# Altium project PX4FMUv2.4.6.PrjPcb (part 1 of 2)
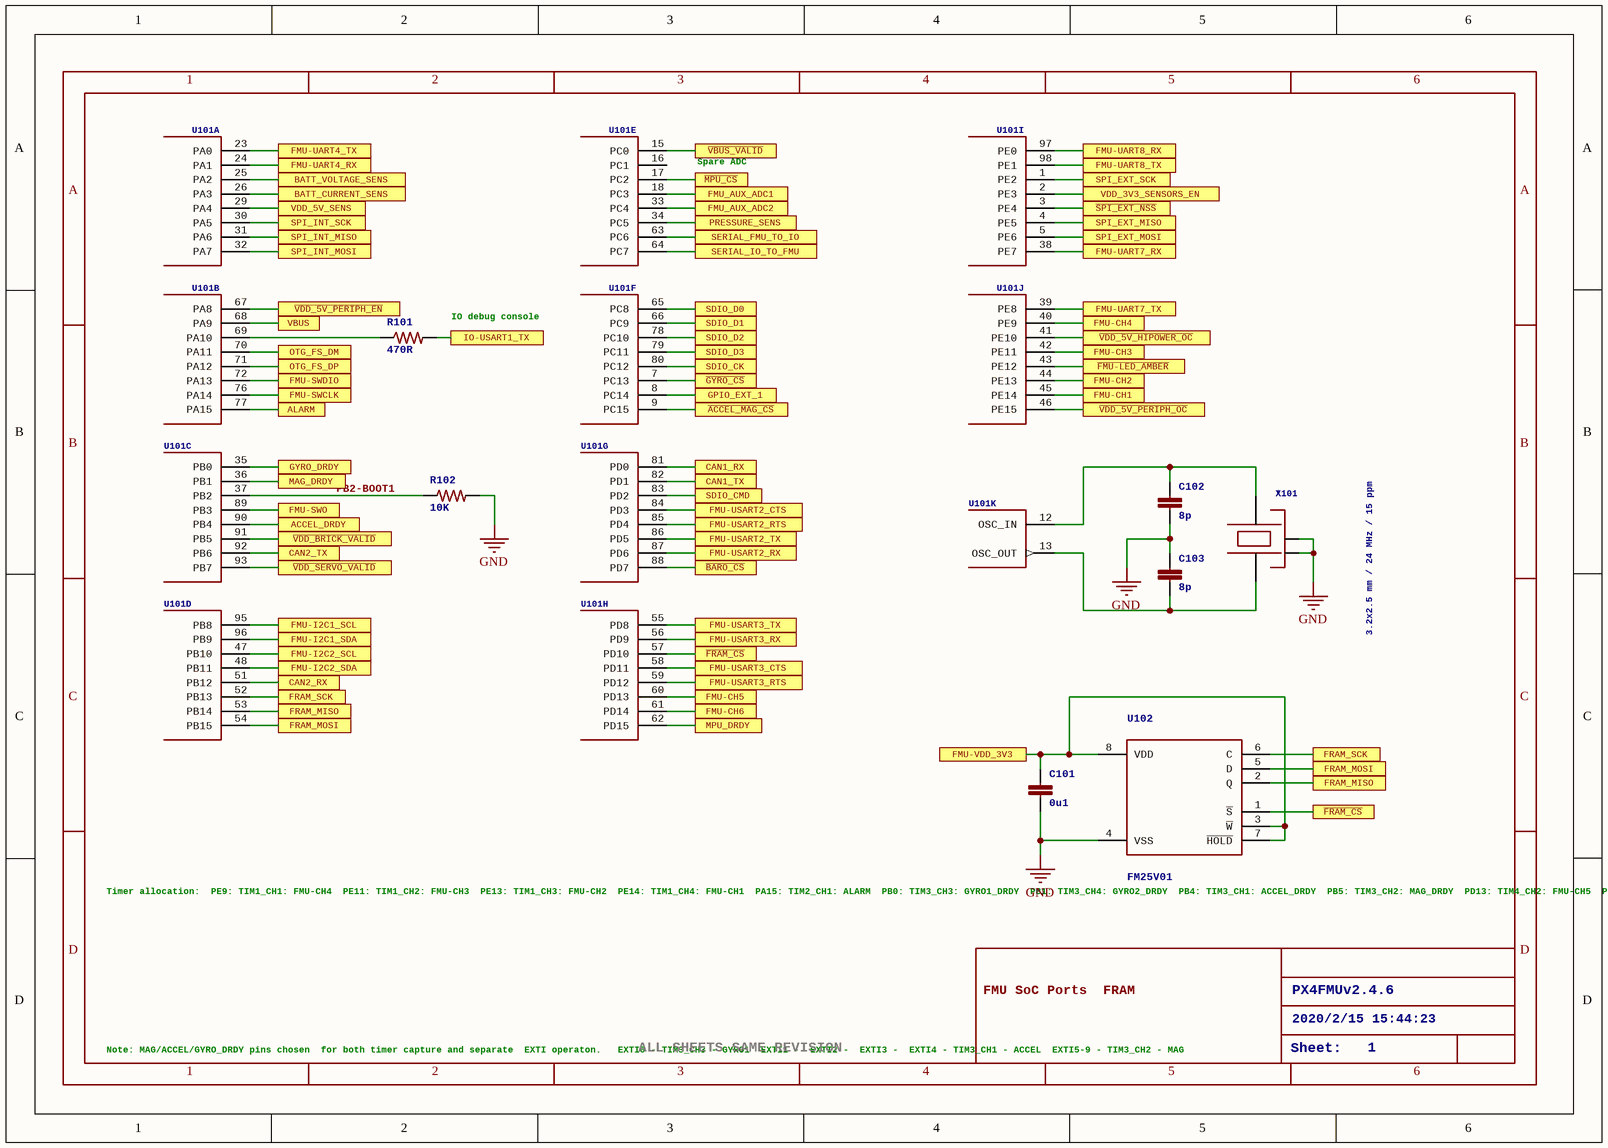
[diagram p0: PX4FMUv2.4.6_0.SchDoc]
12 sheets, 288 parts. Net scope: flat (ports and power ports of the same name join across sheets).
Board file: PX4FMUv2.4.6.PcbDoc
Sheets:
  PX4FMUv2.4.6_0.SchDoc
  PX4FMUv2.4.6_1.SchDoc
  PX4FMUv2.4.6_2.SchDoc
  PX4FMUv2.4.6_3.SchDoc
  PX4FMUv2.4.6_4.SchDoc
  PX4FMUv2.4.6_5.SchDoc
  PX4FMUv2.4.6_6.SchDoc
  PX4FMUv2.4.6_7.SchDoc
  PX4FMUv2.4.6_8.SchDoc
  PX4FMUv2.4.6_9.SchDoc
  PX4FMUv2.4.6_10.SchDoc
  PX4FMUv2.4.6_11.SchDoc

## Sheet PX4FMUv2.4.6_0.SchDoc: PX4FMUv2.4.6
size 282 x 200 mm; Date: 2020/2/15 15:44:23; SheetNumber: 1; GateName_1: G$1; SymbolName_1: A4L-LOC; LibraryName: pixhawk2; DeviceSetName: A4L-LOC

### Parts
C101  0u1  [0402-CAP]
C102  8p  [0402-CAP]
C103  8p  [0402-CAP]
R101  470R  [0402-RES]
R102  10K  [0402-RES]
U101  STM32F4X7VX  [TQFP100]  (value not drawn)  (parts A,B,C,D,E,F,G,H,I,J,K of 14)
U102  FM25V01  [SO08]
X101  3.2x2.5 mm / 24 MHz / 15 ppm  [OSCILLATOR-3.2X2.5]

### Ports
ACCEL_DRDY, ALARM, BATT_CURRENT_SENS, BATT_VOLTAGE_SENS, CAN1_RX, CAN1_TX, CAN2_RX, CAN2_TX, FMU-CH1, FMU-CH2, FMU-CH3, FMU-CH4, FMU-CH5, FMU-CH6, FMU-I2C1_SCL, FMU-I2C1_SDA, FMU-I2C2_SCL, FMU-I2C2_SDA, FMU-SWCLK, FMU-SWDIO, FMU-SWO, FMU-UART4_RX, FMU-UART4_TX, FMU-UART7_RX, FMU-UART7_TX, FMU-UART8_RX, FMU-UART8_TX, FMU-USART2_CTS, FMU-USART2_RTS, FMU-USART2_RX, FMU-USART2_TX, FMU-USART3_CTS, FMU-USART3_RTS, FMU-USART3_RX, FMU-USART3_TX, FMU-VDD_3V3, FMU_AUX_ADC1, FMU_AUX_ADC2, FRAM_MISO, FRAM_MOSI, FRAM_SCK, GPIO_EXT_1, GYRO_DRDY, IO-USART1_TX, MAG_DRDY, MPU_DRDY, OTG_FS_DM, OTG_FS_DP, PRESSURE_SENS, SDIO_CK, SDIO_CMD, SDIO_D0, SDIO_D1, SDIO_D2, SDIO_D3, SERIAL_FMU_TO_IO, SERIAL_IO_TO_FMU, SPI_EXT_MISO, SPI_EXT_MOSI, SPI_EXT_SCK, SPI_INT_MISO, SPI_INT_MOSI, SPI_INT_SCK, VBUS, VDD_3V3_SENSORS_EN, VDD_5V_SENS, ~{ACCEL_MAG_CS}, ~{BARO_CS}, ~{FMU-LED_AMBER}, ~{FRAM_CS}, ~{GYRO_CS}, ~{MPU_CS}, ~{SPI_EXT_NSS}, ~{VBUS_VALID}, ~{VDD_5V_HIPOWER_OC}, ~{VDD_5V_PERIPH_EN}, ~{VDD_5V_PERIPH_OC}, ~{VDD_BRICK_VALID}, ~{VDD_SERVO_VALID}

### Nets
GND: C101.P$2 C102.P$2 C103.P$1 R102.P$2 U102.4(VSS) X101.2(NC_2) X101.4(NC_4)
PB2-BOOT1: R102.P$1 U101.37(PB2)
Net!VBUS_VALID_P$1: U101.15(PC0) ; port ~{VBUS_VALID}
Net!VDD_BRICK_VALID_P$1: U101.91(PB5) ; port ~{VDD_BRICK_VALID}
Net!VDD_SERVO_VALID_P$1: U101.93(PB7) ; port ~{VDD_SERVO_VALID}
NetC101_P$1: C101.P$1 U102.3(~{W}) U102.7(~{HOLD}) U102.8(VDD) ; port FMU-VDD_3V3
NetC102_P$1: C102.P$1 U101.12(OSC_IN) X101.3
NetC103_P$2: C103.P$2 U101.13(OSC_OUT) X101.1
NetC401_P$1: U101.34(PC5) ; port PRESSURE_SENS
NetC1103_P$1: U101.68(PA9) ; port VBUS
NetJ403_2: U101.1(PE2) ; port SPI_EXT_SCK
NetJ403_3: U101.4(PE5) ; port SPI_EXT_MISO
NetJ403_4: U101.5(PE6) ; port SPI_EXT_MOSI
NetJ403_5: U101.3(PE4) ; port ~{SPI_EXT_NSS}
NetJ403_6: U101.8(PC14) ; port GPIO_EXT_1
NetJX301_2: U101.72(PA13) ; port FMU-SWDIO
NetJX301_4: U101.76(PA14) ; port FMU-SWCLK
NetJX301_6: U101.89(PB3) ; port FMU-SWO
NetJX801_1: R101.P$2 ; port IO-USART1_TX
NetR101_P$1: R101.P$1 U101.69(PA10)
NetR215_P$1: U101.92(PB6) ; port CAN2_TX
NetR216_P$1: U101.51(PB12) ; port CAN2_RX
NetR301_P$1: U101.78(PC10) ; port SDIO_D2
NetR302_P$1: U101.79(PC11) ; port SDIO_D3
NetR303_P$1: U101.83(PD2) ; port SDIO_CMD
NetR304_P$1: U101.65(PC8) ; port SDIO_D0
NetR305_P$1: U101.66(PC9) ; port SDIO_D1
NetR306_P$1: U101.47(PB10) ; port FMU-I2C2_SCL
NetR307_P$1: U101.48(PB11) ; port FMU-I2C2_SDA
NetR401_P$1: U101.95(PB8) ; port FMU-I2C1_SCL
NetR402_P$1: U101.96(PB9) ; port FMU-I2C1_SDA
NetR407_P$1: U101.33(PC4) ; port FMU_AUX_ADC2
NetR408_P$1: U101.18(PC3) ; port FMU_AUX_ADC1
NetR602_P$1: U101.41(PE10) ; port ~{VDD_5V_HIPOWER_OC}
NetR603_P$2: U101.2(PE3) ; port VDD_3V3_SENSORS_EN
NetR604_P$1: U101.46(PE15) ; port ~{VDD_5V_PERIPH_OC}
NetR609_P$1: U101.29(PA4) ; port VDD_5V_SENS
NetR615_P$1: U101.67(PA8) ; port ~{VDD_5V_PERIPH_EN}
NetR701_P$2: U101.77(PA15) ; port ALARM
NetR707_P$1: U101.43(PE12) ; port ~{FMU-LED_AMBER}
NetR803_P$2: U101.64(PC7) ; port SERIAL_IO_TO_FMU
NetR804_P$2: U101.63(PC6) ; port SERIAL_FMU_TO_IO
NetR1101_P$1: U101.26(PA3) ; port BATT_CURRENT_SENS
NetR1102_P$1: U101.25(PA2) ; port BATT_VOLTAGE_SENS
NetU101_7: U101.7(PC13) ; port ~{GYRO_CS}
NetU101_9: U101.9(PC15) ; port ~{ACCEL_MAG_CS}
NetU101_17: U101.17(PC2) ; port ~{MPU_CS}
NetU101_23: U101.23(PA0) ; port FMU-UART4_TX
NetU101_24: U101.24(PA1) ; port FMU-UART4_RX
NetU101_30: U101.30(PA5) ; port SPI_INT_SCK
NetU101_31: U101.31(PA6) ; port SPI_INT_MISO
NetU101_32: U101.32(PA7) ; port SPI_INT_MOSI
NetU101_35: U101.35(PB0) ; port GYRO_DRDY
NetU101_36: U101.36(PB1) ; port MAG_DRDY
NetU101_38: U101.38(PE7) ; port FMU-UART7_RX
NetU101_39: U101.39(PE8) ; port FMU-UART7_TX
NetU101_40: U101.40(PE9) ; port FMU-CH4
NetU101_42: U101.42(PE11) ; port FMU-CH3
NetU101_44: U101.44(PE13) ; port FMU-CH2
NetU101_45: U101.45(PE14) ; port FMU-CH1
NetU101_52: U101.52(PB13) U102.6(C) ; port FRAM_SCK
NetU101_53: U101.53(PB14) U102.2(Q) ; port FRAM_MISO
NetU101_54: U101.54(PB15) U102.5(D) ; port FRAM_MOSI
NetU101_55: U101.55(PD8) ; port FMU-USART3_TX
NetU101_56: U101.56(PD9) ; port FMU-USART3_RX
NetU101_57: U101.57(PD10) U102.1(~{S}) ; port ~{FRAM_CS}
NetU101_58: U101.58(PD11) ; port FMU-USART3_CTS
NetU101_59: U101.59(PD12) ; port FMU-USART3_RTS
NetU101_60: U101.60(PD13) ; port FMU-CH5
NetU101_61: U101.61(PD14) ; port FMU-CH6
NetU101_62: U101.62(PD15) ; port MPU_DRDY
NetU101_70: U101.70(PA11) ; port OTG_FS_DM
NetU101_71: U101.71(PA12) ; port OTG_FS_DP
NetU101_80: U101.80(PC12) ; port SDIO_CK
NetU101_81: U101.81(PD0) ; port CAN1_RX
NetU101_82: U101.82(PD1) ; port CAN1_TX
NetU101_84: U101.84(PD3) ; port FMU-USART2_CTS
NetU101_85: U101.85(PD4) ; port FMU-USART2_RTS
NetU101_86: U101.86(PD5) ; port FMU-USART2_TX
NetU101_87: U101.87(PD6) ; port FMU-USART2_RX
NetU101_88: U101.88(PD7) ; port ~{BARO_CS}
NetU101_90: U101.90(PB4) ; port ACCEL_DRDY
NetU101_97: U101.97(PE0) ; port FMU-UART8_RX
NetU101_98: U101.98(PE1) ; port FMU-UART8_TX

Not connected (* = marked no-connect by the designer): U101 16(PC1)

### Notes on the sheet
- Spare ADC
- (near R101) IO debug console
- (near U102) Timer allocation:
  PE9: TIM1_CH1: FMU-CH4
  PE11: TIM1_CH2: FMU-CH3
  PE13: TIM1_CH3: FMU-CH2
  PE14: TIM1_CH4: FMU-CH1
  PA15: TIM2_CH1: ALARM
  PB0: TIM3_CH3: GYRO1_DRDY
  PB1: TIM3_CH4: GYRO2_DRDY
  PB4: TIM3_CH1: ACCEL_DRDY
  PB5: TIM3_CH2: MAG_DRDY
  PD13: TIM4_CH2: FMU-CH5
  PD14: TIM4_CH3: FMU-CH6
  PD15: TIM4_CH4: spare
- FMU SoC Ports
  FRAM
- PX4FMUv2.4.6
- 2020/2/15 15:44:23
- Note: MAG/ACCEL/GYRO_DRDY pins chosen
  for both timer capture and separate
  EXTI operaton.
  EXTI0 - TIM3_CH3 - GYRO1
  EXTI1 -
  EXTI2 -
  EXTI3 -
  EXTI4 - TIM3_CH1 - ACCEL
  EXTI5-9 - TIM3_CH2 - MAG
- ALL SHEETS SAME REVISION
- Sheet:
- 1
- 2
- 3
- 4
- 5
- 6
- A
- B
- C
- D

### Library data of the parts
C101 = CAP0402: CapacitorStandard 0603 ceramic capacitor, and 0.1" leaded capacitor.; PARTNO: CC0402ZRY5V7BB104; GateName_1: G$1; SymbolName_1: CAP; DeviceName: 0402; LibraryName: pixhawk2; DeviceSetName: CAP
C102 C103 = CAP0402: CapacitorStandard 0603 ceramic capacitor, and 0.1" leaded capacitor.; PARTNO: C1005C0G1H080C; GateName_1: G$1; SymbolName_1: CAP; DeviceName: 0402; LibraryName: pixhawk2; DeviceSetName: CAP
R101 = RESISTOR0402-RES: ResistorBasic schematic elements and footprints for 0603, 1206, and PTH 1/10th watt (small) resistors.; PARTNO: RC0402FR-07470RL; GateName_1: G$1; SymbolName_1: RESISTOR; DeviceName: 0402-RES; LibraryName: pixhawk2; DeviceSetName: RESISTOR
R102 = RESISTOR0402-RES: ResistorBasic schematic elements and footprints for 0603, 1206, and PTH 1/10th watt (small) resistors.; PARTNO: RC0402FR-0710KL; GateName_1: G$1; SymbolName_1: RESISTOR; DeviceName: 0402-RES; LibraryName: pixhawk2; DeviceSetName: RESISTOR
U101 = STM32F4X7VX: STM32F4X7VX 100 pin LQFP STM32F407VE - 512 KB flash, no crypto STM32F407VG - 1 MB flash, no crypto STM32F417VE - 512 KB flash, with crypto STM32F417VG - 1 MB flash, with crypto; PARTNO: STM32F427VI; GateName_1: PORTA_L; SymbolName_1: PORT_A_L-1; GateName_2: PORTA_H; SymbolName_2: PORT_A_H-1; GateName_3: PORTB_L; SymbolName_3: PORT_B_L-1; GateName_4: PORTB_H; SymbolName_4: PORT_B_H-1; GateName_5: PORTC_L; SymbolName_5: PORT_C_L-1; GateName_6: PORTC_H; SymbolName_6: PORT_C_H-1; GateName_7: PORTD_L; SymbolName_7: PORT_D_L; GateName_8: PORTD_H; SymbolName_8: PORT_D_H; GateName_9: PORTE_L; SymbolName_9: PORT_E_L; GateName_10: PORTE_H; SymbolName_10: PORT_E_H; GateName_11: OSC; GateName_12: RESET; SymbolName_12: BOOT_RST-1; GateName_13: BAT; SymbolName_13: STM32F4X_BAT_AN_L; GateName_14: G$2; SymbolName_14: STM32F4X_VCC_VSS_L; SymbolName_11: OSC; LibraryName: pixhawk2; DeviceSetName: STM32F4X7VX
U102 = FM25V01: FM25V01 128Kb Serial 3V F-RAM Memory; PARTNO: FM25V01-G; GateName_1: G$1; SymbolName_1: FM25V01; LibraryName: pixhawk2; DeviceSetName: FM25V01; DATASHEET: http://www.ramtron.com/files/datasheets/FM25V01_ds.pdf; LINK: http://www.digikey.com/product-detail/en/FM25V01-GTR/1140-1026-1-ND/2809832; MFGPN: FM25V01
X101 = OSCILLATOR-3.2X2.5: Crystal Oscillator in 3.2x2.5 SMD; PARTNO: NX3225SA-24.000000MHZ; GateName_1: G$1; SymbolName_1: XTAL; DeviceName: -3.2X2.5; LibraryName: pixhawk2; DeviceSetName: OSCILLATOR; NAME: *

## Sheet PX4FMUv2.4.6_1.SchDoc: PX4FMUv2.4.6
size 282 x 200 mm; Date: 2020/2/15 15:44:24; SheetNumber: 2; GateName_1: G$1; SymbolName_1: A4L-LOC; LibraryName: pixhawk2; DeviceSetName: A4L-LOC
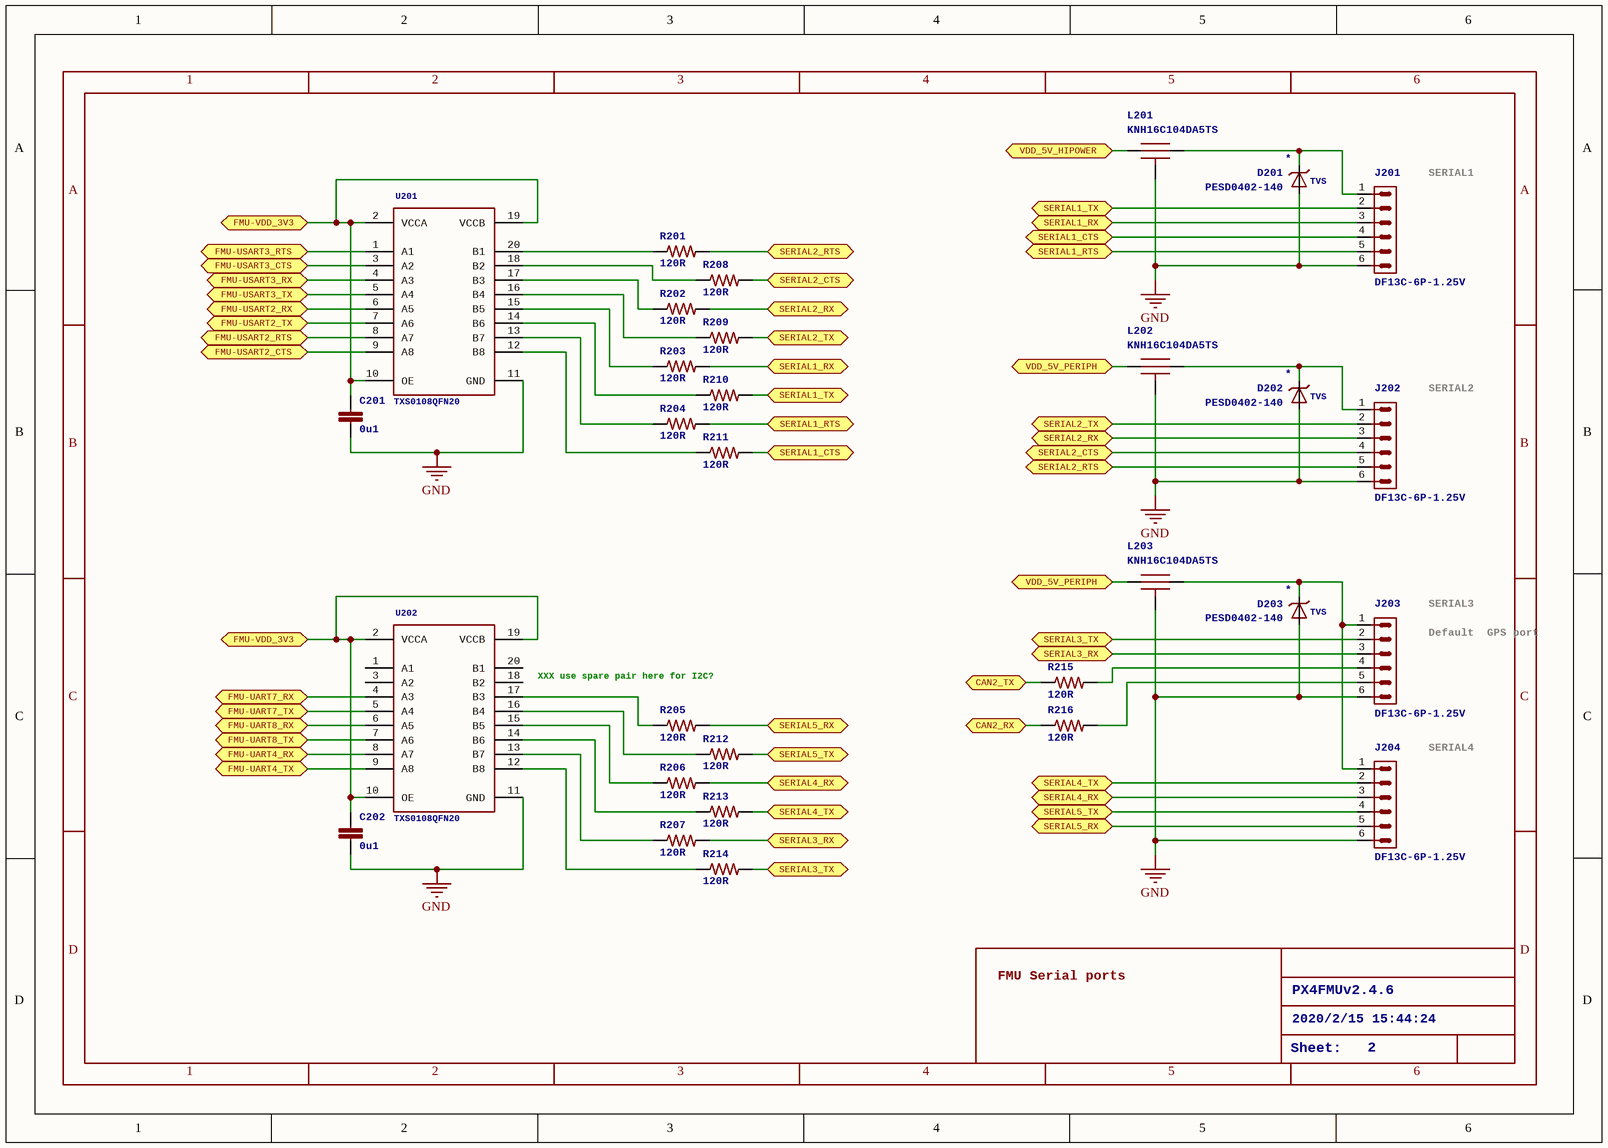
[diagram p1: PX4FMUv2.4.6_1.SchDoc]

### Parts
C201  0u1  [0402-CAP]
C202  0u1  [0402-CAP]
D201  PESD0402-140  [0402-TVS]
D202  PESD0402-140  [0402-TVS]
D203  PESD0402-140  [0402-TVS]
J201  DF13C-6P-1.25V  [DF13C-6P-1.25V]
J202  DF13C-6P-1.25V  [DF13C-6P-1.25V]
J203  DF13C-6P-1.25V  [DF13C-6P-1.25V]
J204  DF13C-6P-1.25V  [DF13C-6P-1.25V]
L201  KNH16C104DA5TS  [KYOCERA-KNH16-DA]
L202  KNH16C104DA5TS  [KYOCERA-KNH16-DA]
L203  KNH16C104DA5TS  [KYOCERA-KNH16-DA]
R201  120R  [0402-RES]
R202  120R  [0402-RES]
R203  120R  [0402-RES]
R204  120R  [0402-RES]
R205  120R  [0402-RES]
R206  120R  [0402-RES]
R207  120R  [0402-RES]
R208  120R  [0402-RES]
R209  120R  [0402-RES]
R210  120R  [0402-RES]
R211  120R  [0402-RES]
R212  120R  [0402-RES]
R213  120R  [0402-RES]
R214  120R  [0402-RES]
R215  120R  [0402-RES]
R216  120R  [0402-RES]
U201  TXS0108QFN20  [QFN20-RGY]
U202  TXS0108QFN20  [QFN20-RGY]

### Ports
CAN2_RX, CAN2_TX, FMU-UART4_RX, FMU-UART4_TX, FMU-UART7_RX, FMU-UART7_TX, FMU-UART8_RX, FMU-UART8_TX, FMU-USART2_CTS, FMU-USART2_RTS, FMU-USART2_RX, FMU-USART2_TX, FMU-USART3_CTS, FMU-USART3_RTS, FMU-USART3_RX, FMU-USART3_TX, FMU-VDD_3V3, SERIAL1_CTS, SERIAL1_RTS, SERIAL1_RX, SERIAL1_TX, SERIAL2_CTS, SERIAL2_RTS, SERIAL2_RX, SERIAL2_TX, SERIAL3_RX, SERIAL3_TX, SERIAL4_RX, SERIAL4_TX, SERIAL5_RX, SERIAL5_TX, VDD_5V_HIPOWER, VDD_5V_PERIPH

### Nets
GND: C201.P$2 C202.P$2 D201.A D202.A D203.A J201.6 J202.6 J203.6 J204.6 L201.P$3_P$4_P$5(P$3) L202.P$3_P$4_P$5(P$3) L203.P$3_P$4_P$5(P$3) U201.11(GND) U202.11(GND)
NetC101_P$1: C201.P$1 C202.P$1 U201.2(VCCA) U201.10(OE) U201.19(VCCB) U202.2(VCCA) U202.10(OE) U202.19(VCCB) ; port FMU-VDD_3V3
NetC614_P$1: L201.P$1 ; port VDD_5V_HIPOWER
NetC618_P$1: L202.P$1 L203.P$1 ; port VDD_5V_PERIPH
NetD201_C: D201.C J201.1 L201.P$2
NetD202_C: D202.C J202.1 L202.P$2
NetD203_C: D203.C J203.1 J204.1 L203.P$2
NetJ201_2: J201.2 R210.P$2 ; port SERIAL1_TX
NetJ201_3: J201.3 R203.P$2 ; port SERIAL1_RX
NetJ201_4: J201.4 R211.P$2 ; port SERIAL1_CTS
NetJ201_5: J201.5 R204.P$2 ; port SERIAL1_RTS
NetJ202_2: J202.2 R209.P$2 ; port SERIAL2_TX
NetJ202_3: J202.3 R202.P$2 ; port SERIAL2_RX
NetJ202_4: J202.4 R208.P$2 ; port SERIAL2_CTS
NetJ202_5: J202.5 R201.P$2 ; port SERIAL2_RTS
NetJ203_2: J203.2 R214.P$2 ; port SERIAL3_TX
NetJ203_3: J203.3 R207.P$2 ; port SERIAL3_RX
NetJ203_4: J203.4 R215.P$2
NetJ203_5: J203.5 R216.P$2
NetJ204_2: J204.2 R213.P$2 ; port SERIAL4_TX
NetJ204_3: J204.3 R206.P$2 ; port SERIAL4_RX
NetJ204_4: J204.4 R212.P$2 ; port SERIAL5_TX
NetJ204_5: J204.5 R205.P$2 ; port SERIAL5_RX
NetR201_P$1: R201.P$1 U201.20(B1)
NetR202_P$1: R202.P$1 U201.17(B3)
NetR203_P$1: R203.P$1 U201.15(B5)
NetR204_P$1: R204.P$1 U201.13(B7)
NetR205_P$1: R205.P$1 U202.17(B3)
NetR206_P$1: R206.P$1 U202.15(B5)
NetR207_P$1: R207.P$1 U202.13(B7)
NetR208_P$1: R208.P$1 U201.18(B2)
NetR209_P$1: R209.P$1 U201.16(B4)
NetR210_P$1: R210.P$1 U201.14(B6)
NetR211_P$1: R211.P$1 U201.12(B8)
NetR212_P$1: R212.P$1 U202.16(B4)
NetR213_P$1: R213.P$1 U202.14(B6)
NetR214_P$1: R214.P$1 U202.12(B8)
NetR215_P$1: R215.P$1 ; port CAN2_TX
NetR216_P$1: R216.P$1 ; port CAN2_RX
NetU101_23: U202.9(A8) ; port FMU-UART4_TX
NetU101_24: U202.8(A7) ; port FMU-UART4_RX
NetU101_38: U202.4(A3) ; port FMU-UART7_RX
NetU101_39: U202.5(A4) ; port FMU-UART7_TX
NetU101_55: U201.5(A4) ; port FMU-USART3_TX
NetU101_56: U201.4(A3) ; port FMU-USART3_RX
NetU101_58: U201.3(A2) ; port FMU-USART3_CTS
NetU101_59: U201.1(A1) ; port FMU-USART3_RTS
NetU101_84: U201.9(A8) ; port FMU-USART2_CTS
NetU101_85: U201.8(A7) ; port FMU-USART2_RTS
NetU101_86: U201.7(A6) ; port FMU-USART2_TX
NetU101_87: U201.6(A5) ; port FMU-USART2_RX
NetU101_97: U202.6(A5) ; port FMU-UART8_RX
NetU101_98: U202.7(A6) ; port FMU-UART8_TX

Not connected (* = marked no-connect by the designer): U202 1(A1) 3(A2) 18(B2) 20(B1)

### Notes on the sheet
- SERIAL1
- SERIAL2
- SERIAL3
- Default
  GPS port
- XXX use spare pair here for I2C?
- SERIAL4
- FMU Serial ports
- PX4FMUv2.4.6
- 2020/2/15 15:44:24
- Sheet:
- 2
- 1
- 3
- 4
- 5
- 6
- A
- B
- C
- D

### Library data of the parts
C201 C202 = CAP0402: as C101 on sheet PX4FMUv2.4.6_0; LibraryName: pixhawk2; DeviceSetName: CAP
D201-D203 = DIODE-TVS: GateName_1: G$1; SymbolName_1: DIODE-TVS; LibraryName: pixhawk2; DeviceSetName: DIODE-TVS; NAME: *; PARTNO: PESD0402-140; TVS: TVS
J201-J204 = DF13-6P-1.25V: DF13-6P 1.25mm Pitch Miniature Crimping Connector.; PARTNO: DF13C-6P-1.25V(20); GateName_1: G$1; SymbolName_1: CON-1X6P; DeviceName: V; LibraryName: con-hirose-df13; DeviceSetName: DF13-6P-1.25
L201-L203 = KNH16C104DA5TS: Kyocera KNH16C104DA5TS EMI filter; GateName_1: G$1; SymbolName_1: CAP-FEEDTHROUGH; LibraryName: pixhawk2; DeviceSetName: KNH16C104DA5TS; PARTNO: KNH16C104DA5TS
R201-R216 = RESISTOR0402-RES: ResistorBasic schematic elements and footprints for 0603, 1206, and PTH 1/10th watt (small) resistors.; PARTNO: RC0402FR-07120RL; GateName_1: G$1; SymbolName_1: RESISTOR; DeviceName: 0402-RES; LibraryName: pixhawk2; DeviceSetName: RESISTOR
U201 U202 = TXS0108QFN20: PARTNO: TXS0108ERGYR; GateName_1: G$1; SymbolName_1: TX?0108; DeviceName: QFN20; LibraryName: pixhawk2; DeviceSetName: TXS0108

## Sheet PX4FMUv2.4.6_2.SchDoc: PX4FMUv2.4.6
size 282 x 200 mm; Date: 2020/2/15 15:44:25; SheetNumber: 3; GateName_1: G$1; SymbolName_1: A4L-LOC; LibraryName: pixhawk2; DeviceSetName: A4L-LOC
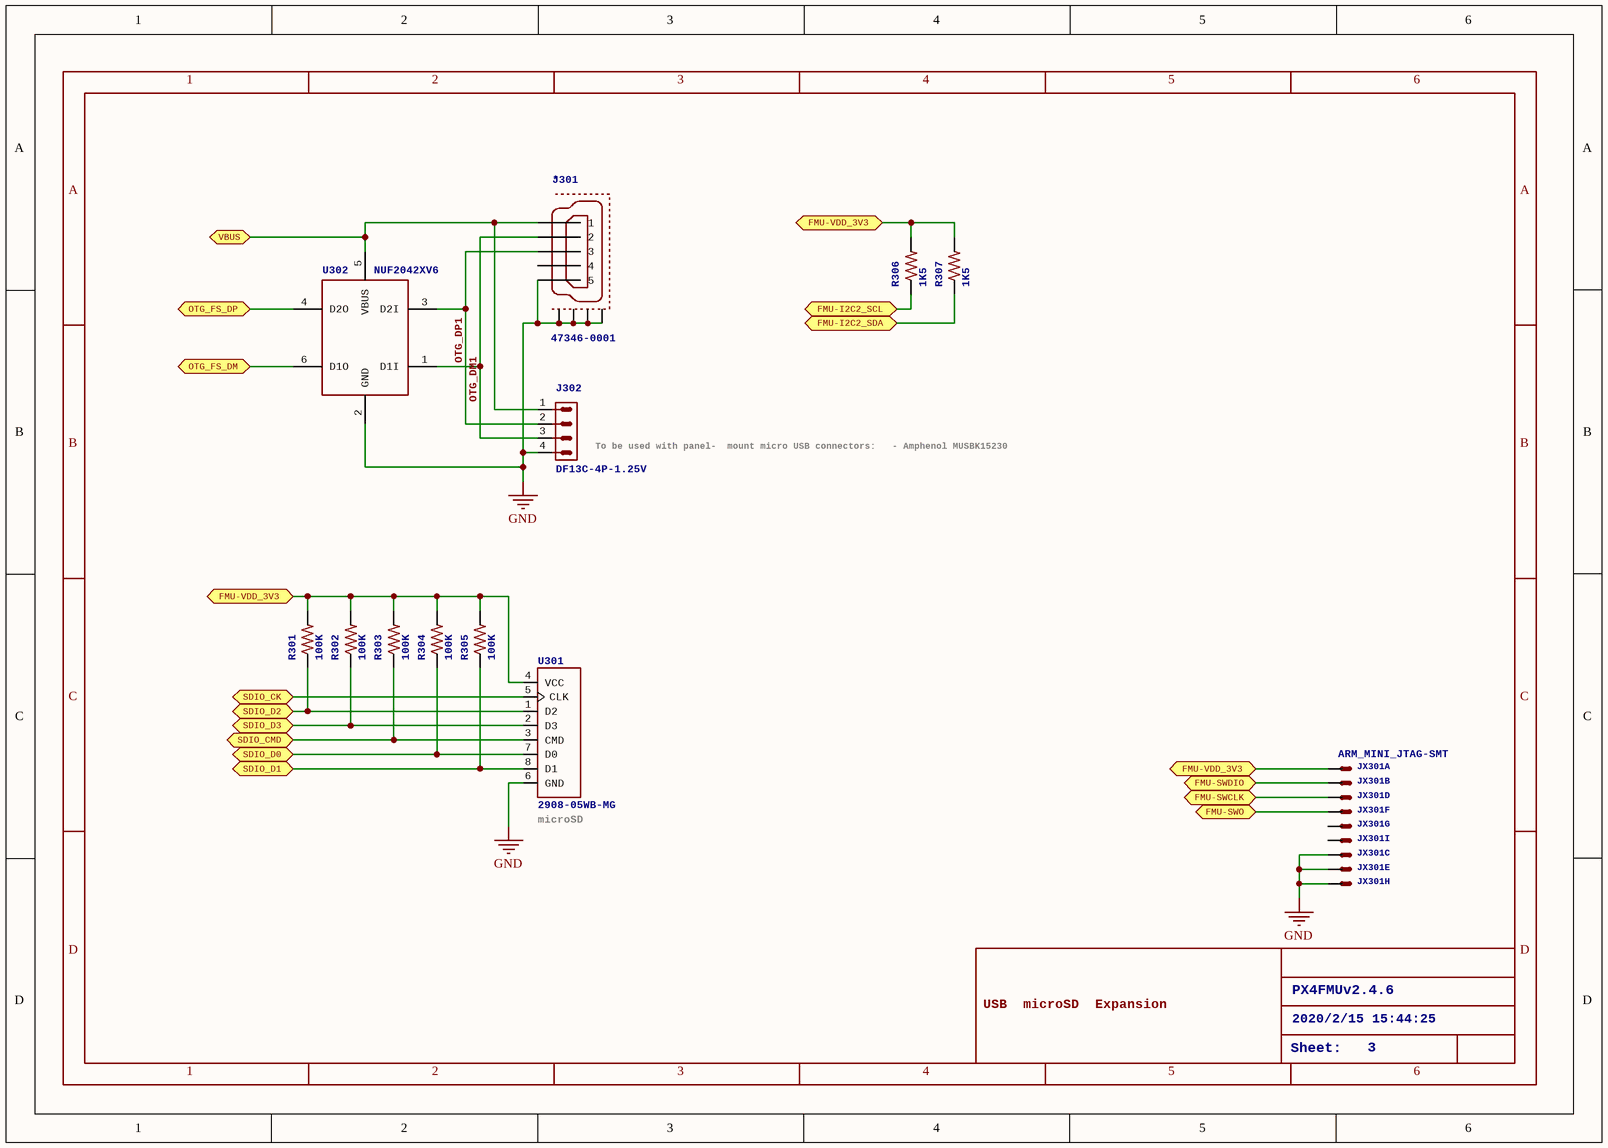
[diagram p2: PX4FMUv2.4.6_2.SchDoc]

### Parts
J301  47346-0001  [MOLEX-47346-0001]
J302  DF13C-4P-1.25V  [DF13C-4P-1.25V]
JX301  ARM_MINI_JTAG-SMT  [FTSH-105-01-XXX-DV-K]  (parts A,B,C,D,E,F,G,H,I of 9)
R301  100K  [0402-RES]
R302  100K  [0402-RES]
R303  100K  [0402-RES]
R304  100K  [0402-RES]
R305  100K  [0402-RES]
R306  1K5  [0402-RES]
R307  1K5  [0402-RES]
U301  2908-05WB-MG  [MICROSD]
U302  NUF2042XV6  [SOT563-6]

### Ports
FMU-I2C2_SCL, FMU-I2C2_SDA, FMU-SWCLK, FMU-SWDIO, FMU-SWO, FMU-VDD_3V3, OTG_FS_DM, OTG_FS_DP, SDIO_CK, SDIO_CMD, SDIO_D0, SDIO_D1, SDIO_D2, SDIO_D3, VBUS

### Nets
GND: J301.GND(5) J301.GND1 J301.GND2 J301.GND3 J301.GND4 J302.4 JX301.3(S) JX301.5(S) JX301.9(S) U301.6(GND) U302.2(GND)
OTG_DM1: J301.D-(2) J302.3 U302.1(D1I)
OTG_DP1: J301.D+(3) J302.2 U302.3(D2I)
NetC101_P$1: JX301.1(S) R301.P$2 R302.P$2 R303.P$2 R304.P$2 R305.P$2 R306.P$2 R307.P$2 U301.4(VCC) ; port FMU-VDD_3V3
NetC1103_P$1: J301.VBUS(1) J302.1 U302.5(VBUS) ; port VBUS
NetJX301_2: JX301.2(S) ; port FMU-SWDIO
NetJX301_4: JX301.4(S) ; port FMU-SWCLK
NetJX301_6: JX301.6(S) ; port FMU-SWO
NetR301_P$1: R301.P$1 U301.1(D2) ; port SDIO_D2
NetR302_P$1: R302.P$1 U301.2(D3) ; port SDIO_D3
NetR303_P$1: R303.P$1 U301.3(CMD) ; port SDIO_CMD
NetR304_P$1: R304.P$1 U301.7(D0) ; port SDIO_D0
NetR305_P$1: R305.P$1 U301.8(D1) ; port SDIO_D1
NetR306_P$1: R306.P$1 ; port FMU-I2C2_SCL
NetR307_P$1: R307.P$1 ; port FMU-I2C2_SDA
NetU101_70: U302.6(D1O) ; port OTG_FS_DM
NetU101_71: U302.4(D2O) ; port OTG_FS_DP
NetU101_80: U301.5(CLK) ; port SDIO_CK

Not connected (* = marked no-connect by the designer): J301 ID(4); JX301 8(S) 10(S)

### Notes on the sheet
- (near J302) To be used with panel-
  mount micro USB connectors:
  - Amphenol MUSBK15230
- (near U301) microSD
- USB
  microSD
  Expansion
- PX4FMUv2.4.6
- 2020/2/15 15:44:25
- Sheet:
- 3
- 1
- 2
- 4
- 5
- 6
- A
- B
- C
- D

### Library data of the parts
J301 = MOLEX-47346-0001: MICRO USB B, BOTTOM MOUNT; GateName_1: G$1; SymbolName_1: MINI-USB; LibraryName: pixhawk2; DeviceSetName: MOLEX-47346-0001; NAME: *; PARTNO: 47346-0001
J302 = DF13-4P-1.25V: DF13-4P 1.25mm Pitch Miniature Crimping Connector.; PARTNO: DF13C-4P-1.25V(20); GateName_1: G$1; SymbolName_1: CON-1X4P; DeviceName: V; LibraryName: con-hirose-df13; DeviceSetName: DF13-4P-1.25
JX301 = ARM_MINI_JTAG-SMT: CONNECTORwire to board 1.25 mm (.049 inch) pitch header; PARTNO: M50-3900542; GateName_1: -VTREF; SymbolName_1: MV; GateName_2: -TMS/SWDIO; SymbolName_2: M; GateName_3: -GND1; GateName_4: -TCK/SWCLK; GateName_5: -GND2; GateName_6: -TDO/SWO; GateName_7: -TDI/EXTB; GateName_8: -GND3; GateName_9: -!RESET; DeviceName: -SMT; BOM: EXCLUDE; SymbolName_3: M; SymbolName_4: M; SymbolName_5: M; SymbolName_6: M; SymbolName_7: M; SymbolName_8: M; SymbolName_9: M; LibraryName: pixhawk2; DeviceSetName: ARM_MINI_JTAG
R301-R305 = RESISTOR0402-RES: ResistorBasic schematic elements and footprints for 0603, 1206, and PTH 1/10th watt (small) resistors.; PARTNO: RC0402FR-07100KL; GateName_1: G$1; SymbolName_1: RESISTOR; DeviceName: 0402-RES; LibraryName: pixhawk2; DeviceSetName: RESISTOR
R306 R307 = RESISTOR0402-RES: ResistorBasic schematic elements and footprints for 0603, 1206, and PTH 1/10th watt (small) resistors.; PARTNO: RC0402FR-071K5L; GateName_1: G$1; SymbolName_1: RESISTOR; DeviceName: 0402-RES; LibraryName: pixhawk2; DeviceSetName: RESISTOR
U301 = MICROSDSDI: GateName_1: G$1; SymbolName_1: MICROSDSDI; LibraryName: baseboard; DeviceSetName: MICROSDSDI; PARTNO: 2908-05WB-MG
U302 = NUF2042XV6: PARTNO: NUF2042XV6T1G; GateName_1: G$1; SymbolName_1: NUF20X0XV6; LibraryName: pixhawk2; DeviceSetName: NUF2042XV6

## Sheet PX4FMUv2.4.6_3.SchDoc: PX4FMUv2.4.6
size 282 x 200 mm; Date: 2020/2/15 15:44:26; SheetNumber: 4; GateName_1: G$1; SymbolName_1: A4L-LOC; LibraryName: pixhawk2; DeviceSetName: A4L-LOC
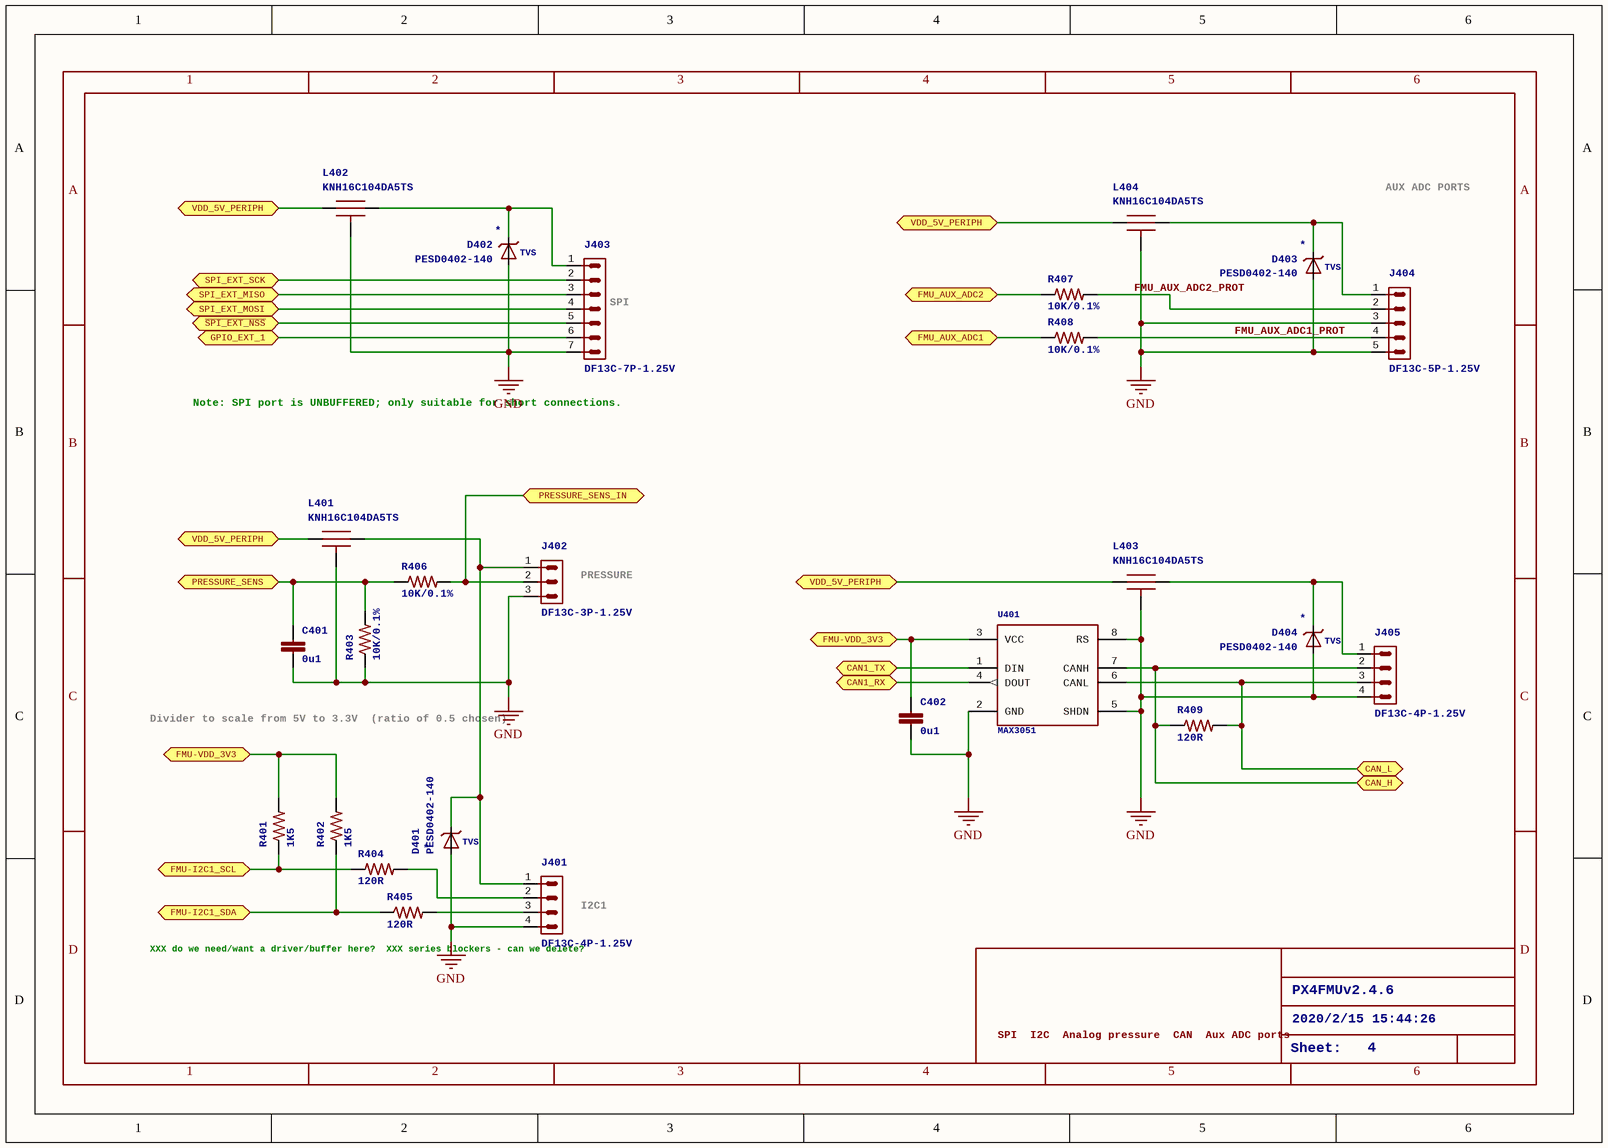
[diagram p3: PX4FMUv2.4.6_3.SchDoc]

### Parts
C401  0u1  [0402-CAP]
C402  0u1  [0402-CAP]
D401  PESD0402-140  [0402-TVS]
D402  PESD0402-140  [0402-TVS]
D403  PESD0402-140  [0402-TVS]
D404  PESD0402-140  [0402-TVS]
J401  DF13C-4P-1.25V  [DF13C-4P-1.25V]
J402  DF13C-3P-1.25V  [DF13C-3P-1.25V]
J403  DF13C-7P-1.25V  [DF13C-7P-1.25V]
J404  DF13C-5P-1.25V  [DF13C-5P-1.25V]
J405  DF13C-4P-1.25V  [DF13C-4P-1.25V]
L401  KNH16C104DA5TS  [KYOCERA-KNH16-DA]
L402  KNH16C104DA5TS  [KYOCERA-KNH16-DA]
L403  KNH16C104DA5TS  [KYOCERA-KNH16-DA]
L404  KNH16C104DA5TS  [KYOCERA-KNH16-DA]
R401  1K5  [0402-RES]
R402  1K5  [0402-RES]
R403  10K/0.1%  [0402-RES]
R404  120R  [0402-RES]
R405  120R  [0402-RES]
R406  10K/0.1%  [0402-RES]
R407  10K/0.1%  [0402-RES]
R408  10K/0.1%  [0402-RES]
R409  120R  [0402-RES]
U401  MAX3051  [SOT23-8]

### Ports
CAN1_RX, CAN1_TX, CAN_H, CAN_L, FMU-I2C1_SCL, FMU-I2C1_SDA, FMU-VDD_3V3, FMU_AUX_ADC1, FMU_AUX_ADC2, GPIO_EXT_1, PRESSURE_SENS, PRESSURE_SENS_IN, SPI_EXT_MISO, SPI_EXT_MOSI, SPI_EXT_SCK, VDD_5V_PERIPH, ~{SPI_EXT_NSS}

### Nets
GND: C401.P$2 C402.P$2 D401.A D402.A D403.A D404.A J401.4 J402.3 J403.7 J404.3 J404.5 J405.4 L401.P$3_P$4_P$5(P$3) L402.P$3_P$4_P$5(P$3) L403.P$3_P$4_P$5(P$3) L404.P$3_P$4_P$5(P$3) R403.P$1 U401.2(GND) U401.5(SHDN) U401.8(RS)
FMU_AUX_ADC1_PROT: J404.4 R408.P$2
FMU_AUX_ADC2_PROT: J404.2 R407.P$2
NetADC_PR_P$1: J402.2 R406.P$2 ; port PRESSURE_SENS_IN
NetC101_P$1: C402.P$1 R401.P$2 R402.P$2 U401.3(VCC) ; port FMU-VDD_3V3
NetC401_P$1: C401.P$1 R403.P$2 R406.P$1 ; port PRESSURE_SENS
NetC618_P$1: L401.P$1 L402.P$1 L403.P$1 L404.P$1 ; port VDD_5V_PERIPH
NetCAN_H_P$1: J405.2 R409.P$1 U401.7(CANH) ; port CAN_H
NetCAN_L_P$1: J405.3 R409.P$2 U401.6(CANL) ; port CAN_L
NetD401_C: D401.C J401.1 J402.1 L401.P$2
NetD402_C: D402.C J403.1 L402.P$2
NetD403_C: D403.C J404.1 L404.P$2
NetD404_C: D404.C J405.1 L403.P$2
NetJ401_2: J401.2 R404.P$2
NetJ401_3: J401.3 R405.P$2
NetJ403_2: J403.2 ; port SPI_EXT_SCK
NetJ403_3: J403.3 ; port SPI_EXT_MISO
NetJ403_4: J403.4 ; port SPI_EXT_MOSI
NetJ403_5: J403.5 ; port ~{SPI_EXT_NSS}
NetJ403_6: J403.6 ; port GPIO_EXT_1
NetR401_P$1: R401.P$1 R404.P$1 ; port FMU-I2C1_SCL
NetR402_P$1: R402.P$1 R405.P$1 ; port FMU-I2C1_SDA
NetR407_P$1: R407.P$1 ; port FMU_AUX_ADC2
NetR408_P$1: R408.P$1 ; port FMU_AUX_ADC1
NetU101_81: U401.4(DOUT) ; port CAN1_RX
NetU101_82: U401.1(DIN) ; port CAN1_TX

### Notes on the sheet
- AUX ADC PORTS
- (near J403) SPI
- Note: SPI port is UNBUFFERED; only suitable for short connections.
- (near J402) PRESSURE
- Divider to scale from 5V to 3.3V
  (ratio of 0.5 chosen)
- XXX do we need/want a driver/buffer here?
  XXX series blockers - can we delete?
- (near J401) I2C1
- PX4FMUv2.4.6
- 2020/2/15 15:44:26
- SPI
  I2C
  Analog pressure
  CAN
  Aux ADC ports
- Sheet:
- 4
- 1
- 2
- 3
- 5
- 6
- A
- B
- C
- D

### Library data of the parts
C401 C402 = CAP0402: as C101 on sheet PX4FMUv2.4.6_0; LibraryName: pixhawk2; DeviceSetName: CAP
D401-D404 = DIODE-TVS: GateName_1: G$1; SymbolName_1: DIODE-TVS; LibraryName: pixhawk2; DeviceSetName: DIODE-TVS; NAME: *; PARTNO: PESD0402-140; TVS: TVS
J401 J405 = DF13-4P-1.25V: as J302 on sheet PX4FMUv2.4.6_2; LibraryName: con-hirose-df13; DeviceSetName: DF13-4P-1.25
J402 = DF13-3P-1.25V: DF13-3P 1.25mm Pitch Miniature Crimping Connector.; PARTNO: DF13C-3P-1.25V(20); GateName_1: G$1; SymbolName_1: CON-1X3P; DeviceName: V; LibraryName: con-hirose-df13; DeviceSetName: DF13-3P-1.25
J403 = DF13-7P-1.25V: DF13-7P 1.25mm Pitch Miniature Crimping Connector.; PARTNO: DF13C-7P-1.25V(20); GateName_1: G$1; SymbolName_1: CON-1X7P; DeviceName: V; LibraryName: con-hirose-df13; DeviceSetName: DF13-7P-1.25
J404 = DF13-5P-1.25V: DF13-5P 1.25mm Pitch Miniature Crimping Connector.; PARTNO: DF13C-5P-1.25V(20); GateName_1: G$1; SymbolName_1: CON-1X5P; DeviceName: V; LibraryName: con-hirose-df13; DeviceSetName: DF13-5P-1.25
L401-L404 = KNH16C104DA5TS: as L201 on sheet PX4FMUv2.4.6_1; LibraryName: pixhawk2; DeviceSetName: KNH16C104DA5TS; PARTNO: KNH16C104DA5TS
R401 R402 = RESISTOR0402-RES: as R306 on sheet PX4FMUv2.4.6_2; SymbolName_1: RESISTOR; DeviceName: 0402-RES; LibraryName: pixhawk2; DeviceSetName: RESISTOR
R403 R406-R408 = RESISTOR0402-RES: ResistorBasic schematic elements and footprints for 0603, 1206, and PTH 1/10th watt (small) resistors.; PARTNO: ERA-2AEB103X; GateName_1: G$1; SymbolName_1: RESISTOR; DeviceName: 0402-RES; LibraryName: pixhawk2; DeviceSetName: RESISTOR
R404 R405 R409 = RESISTOR0402-RES: as R201 on sheet PX4FMUv2.4.6_1; SymbolName_1: RESISTOR; DeviceName: 0402-RES; LibraryName: pixhawk2; DeviceSetName: RESISTOR
U401 = MAX3051MAX3051EKA: 3.3-V CAN TRANSCEIVER; GateName_1: G$1; SymbolName_1: MAX3051; DeviceName: MAX3051EKA; LibraryName: pixhawk2; DeviceSetName: MAX3051; PARTNO: MAX3051EKA

## Sheet PX4FMUv2.4.6_4.SchDoc: PX4FMUv2.4.6
size 282 x 200 mm; Date: 2020/2/15 15:44:27; SheetNumber: 5; GateName_1: G$1; SymbolName_1: A4L-LOC; LibraryName: pixhawk2; DeviceSetName: A4L-LOC; Value: Sensors
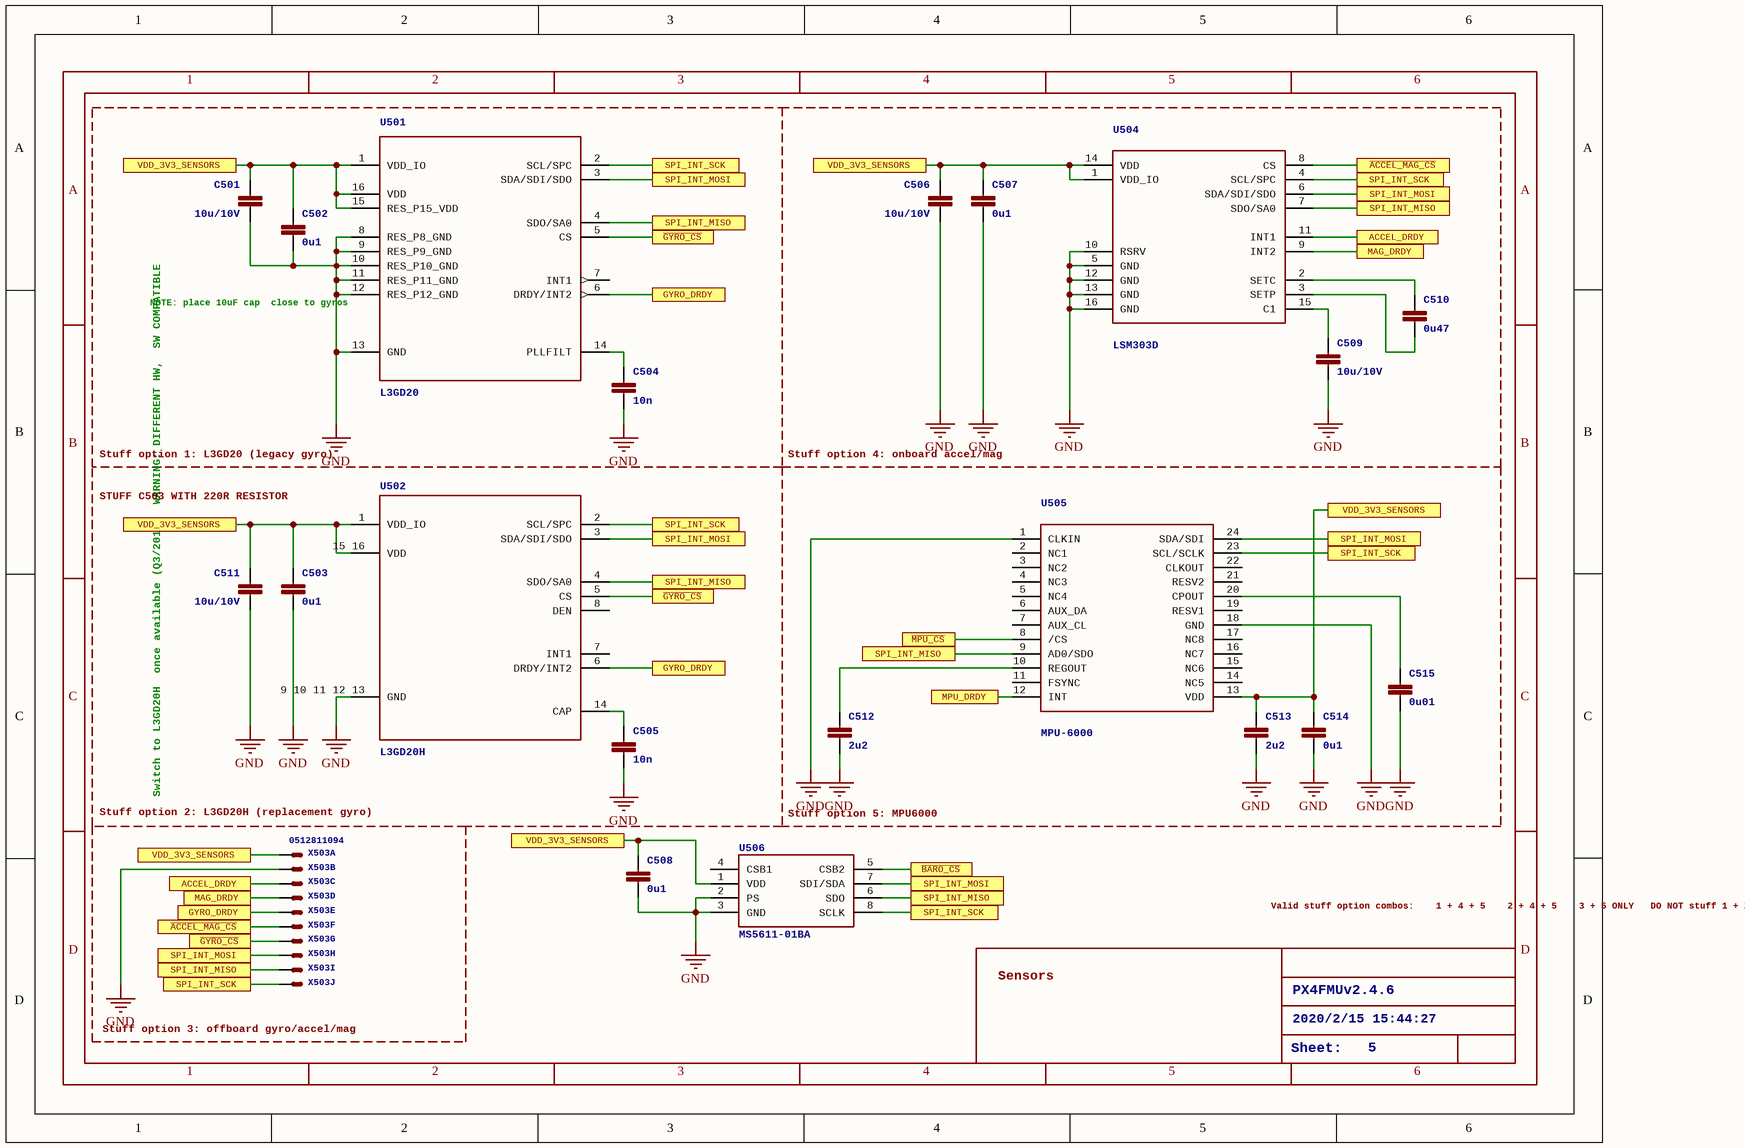
[diagram p4: PX4FMUv2.4.6_4.SchDoc]

### Parts
C501  10u/10V  [0805-CAP]
C502  0u1  [0402-CAP]
C503  0u1  [0402-CAP]
C504  10n  [0402-CAP]
C505  10n  [0402-CAP]
C506  10u/10V  [0805-CAP]
C507  0u1  [0402-CAP]
C508  0u1  [0402-CAP]
C509  10u/10V  [0805-CAP]
C510  0u47  [0402-CAP]
C511  10u/10V  [0805-CAP]
C512  2u2  [0603-CAP]
C513  2u2  [0603-CAP]
C514  0u1  [0402-CAP]
C515  0u01  [0603-CAP]
U501  L3GD20  [L3G4200DH-MAN]
U502  L3GD20H  [LGA-16L]
U504  LSM303D  [LGA-16L]
U505  MPU-6000  [QFN-24]
U506  MS5611-01BA  [MS5611-01BA]
X503  0512811094  [51281-1094]  (parts A,B,C,D,E,F,G,H,I,J of 10)

### Ports
ACCEL_DRDY, GYRO_DRDY, MAG_DRDY, MPU_DRDY, SPI_INT_MISO, SPI_INT_MOSI, SPI_INT_SCK, VDD_3V3_SENSORS, ~{ACCEL_MAG_CS}, ~{BARO_CS}, ~{GYRO_CS}, ~{MPU_CS}

### Nets
GND: C501.P$2 C502.P$2 C503.P$2 C504.P$2 C505.P$2 C506.P$2 C507.P$2 C508.P$2 C509.P$2 C511.P$2 C512.P$2 C513.P$2 C514.P$2 C515.P$2 U501.8(RES_P8_GND) U501.9(RES_P9_GND) U501.10(RES_P10_GND) U501.11(RES_P11_GND) U501.12(RES_P12_GND) U501.13(GND) U502.9_10_11_12_13(GND) U504.5(GND) U504.10(RSRV) U504.12(GND) U504.13(GND) U504.16(GND) U505.1(CLKIN) U505.18(GND) U506.2(PS) U506.3(GND) X503.2(S)
NetC501_P$1: C501.P$1 C502.P$1 C503.P$1 C506.P$1 C507.P$1 C508.P$1 C511.P$1 C513.P$1 C514.P$1 U501.1(VDD_IO) U501.15(RES_P15_VDD) U501.16(VDD) U502.1(VDD_IO) U502.15_16(VDD) U504.1(VDD_IO) U504.14(VDD) U505.13(VDD) U506.1(VDD) X503.1(S) ; port VDD_3V3_SENSORS
NetC504_P$1: C504.P$1 U501.14(PLLFILT)
NetC505_P$1: C505.P$1 U502.14(CAP)
NetC509_P$1: C509.P$1 U504.15(C1)
NetC510_P$1: C510.P$1 U504.2(SETC)
NetC510_P$2: C510.P$2 U504.3(SETP)
NetC512_P$1: C512.P$1 U505.10(REGOUT)
NetC515_P$1: C515.P$1 U505.20(CPOUT)
NetU101_7: U501.5(CS) U502.5(CS) X503.7(S) ; port ~{GYRO_CS}
NetU101_9: U504.8(CS) X503.6(S) ; port ~{ACCEL_MAG_CS}
NetU101_17: U505.8(/CS) ; port ~{MPU_CS}
NetU101_30: U501.2(SCL/SPC) U502.2(SCL/SPC) U504.4(SCL/SPC) U505.23(SCL/SCLK) U506.8(SCLK) X503.10(S) ; port SPI_INT_SCK
NetU101_31: U501.4(SDO/SA0) U502.4(SDO/SA0) U504.7(SDO/SA0) U505.9(AD0/SDO) U506.6(SDO) X503.9(S) ; port SPI_INT_MISO
NetU101_32: U501.3(SDA/SDI/SDO) U502.3(SDA/SDI/SDO) U504.6(SDA/SDI/SDO) U505.24(SDA/SDI) U506.7(SDI/SDA) X503.8(S) ; port SPI_INT_MOSI
NetU101_35: U501.6(DRDY/INT2) U502.6(DRDY/INT2) X503.5(S) ; port GYRO_DRDY
NetU101_36: U504.9(INT2) X503.4(S) ; port MAG_DRDY
NetU101_62: U505.12(INT) ; port MPU_DRDY
NetU101_88: U506.5(CSB2) ; port ~{BARO_CS}
NetU101_90: U504.11(INT1) X503.3(S) ; port ACCEL_DRDY

Not connected (* = marked no-connect by the designer): U501 7(INT1); U502 7(INT1) 8(DEN); U505 2(NC1) 3(NC2) 4(NC3) 5(NC4) 6(AUX_DA) 7(AUX_CL) 11(FSYNC) 14(NC5) 15(NC6) 16(NC7) 17(NC8) 19(RESV1) 21(RESV2) 22(CLKOUT); U506 4(CSB1)

### Notes on the sheet
- NOTE: place 10uF cap
  close to gyros
- Stuff option 1: L3GD20 (legacy gyro)
- STUFF C503 WITH 220R RESISTOR
- Stuff option 4: onboard accel/mag
- Switch to L3GD20H
  once available (Q3/2013)
  WARNING: DIFFERENT HW,
  SW COMPATIBLE
- (near X503) Stuff option 2: L3GD20H (replacement gyro)
- Stuff option 5: MPU6000
- Valid stuff option combos:
  1 + 4 + 5
  2 + 4 + 5
  3 + 5 ONLY
  DO NOT stuff 1 + 2 at the same time
  DO NOT stuff 3 with any of 1, 2 or 4
- Sensors
- PX4FMUv2.4.6
- 2020/2/15 15:44:27
- (near X503) Stuff option 3: offboard gyro/accel/mag
- Sheet:
- 5
- 1
- 2
- 3
- 4
- 6
- A
- B
- C
- D

### Library data of the parts
C501 C506 C509 C511 = CAP0805: CapacitorStandard 0603 ceramic capacitor, and 0.1" leaded capacitor.; PARTNO: CC0805ZKY5V6BB106; GateName_1: G$1; SymbolName_1: CAP; DeviceName: 0805; LibraryName: pixhawk2; DeviceSetName: CAP
C502 C503 C507 C508 C514 = CAP0402: as C101 on sheet PX4FMUv2.4.6_0; LibraryName: pixhawk2; DeviceSetName: CAP
C504 C505 = CAP0402: CapacitorStandard 0603 ceramic capacitor, and 0.1" leaded capacitor.; PARTNO: CC0402KRX7R7BB103; GateName_1: G$1; SymbolName_1: CAP; DeviceName: 0402; LibraryName: pixhawk2; DeviceSetName: CAP
C510 = CAP0402: CapacitorStandard 0603 ceramic capacitor, and 0.1" leaded capacitor.; PARTNO: C1005X5R1C474K050BC; GateName_1: G$1; SymbolName_1: CAP; DeviceName: 0402; LibraryName: pixhawk2; DeviceSetName: CAP
C512 C513 = CAP0603: CapacitorStandard 0603 ceramic capacitor, and 0.1" leaded capacitor.; PARTNO: C1608X6S1C225K080AC; GateName_1: G$1; SymbolName_1: CAP; DeviceName: 0603; LibraryName: pixhawk2; DeviceSetName: CAP
C515 = CAP0603: CapacitorStandard 0603 ceramic capacitor, and 0.1" leaded capacitor.; PARTNO: 06033C103JAT2A; GateName_1: G$1; SymbolName_1: CAP; DeviceName: 0603; LibraryName: pixhawk2; DeviceSetName: CAP
U501 = L3G4200DH-LL: L3G4200DH - Digital 3-axis GyroscopeThe L3G4200DH is a low-power three-axis angular rate sensor. The L3G4200DH has a full scale of 卤250/卤500/ 卤2000 dps and is capable of measuring rates with a user-selectable bandwidth. It can operate within a temperature range from -40 掳C to +85 掳C. Supply voltage: 2.4 V to 3.6 V. Full datasheet:L3G4200DH Datasheet; GateName_1: G$1; DeviceName: -LL; SymbolName_1: L3G4200DH; LibraryName: pixhawk2; DeviceSetName: L3G4200DH; PARTNO: L3GD20
U502 = L3GD20H: L3GD20H MEMS motion sensor: 3-axis digital output gyroscope; GateName_1: G$1; BOM: EXCLUDE; SymbolName_1: L3GD20H; LibraryName: pixhawk2; DeviceSetName: L3GD20H; DATASHEET: http://www.st.com/internet/com/TECHNICAL_RESOURCES/TECHNICAL_LITERATURE/DATASHEET/DM00060659.pdf; LINK: http://www.st.com/internet/analog/product/254039.jsp; MFGPN: L3GD20H; PARTNO: L3GD20H
U504 = LSM303D: LSM303D Ultra compact high performance e-compass: 3D accelerometer and 3D magnetometer module; GateName_1: G$1; SymbolName_1: LSM303D; LibraryName: pixhawk2; DeviceSetName: LSM303D; DATASHEET: http://www.st.com/internet/com/TECHNICAL_RESOURCES/TECHNICAL_LITERATURE/DATASHEET/DM00057547.pdf; LINK: http://www.st.com/internet/analog/product/253884.jsp; MFGPN: LSM303D; PARTNO: LSM303D
U505 = MPU-6000: Invensense MPU-6000: 3-axis gyro, 3-axis accel & 9-axis MotionFusionThe MPU-60X0 Motion Processing Unit (MPU?) is the world?s first motion processing solution with integrated 9-axis sensor fusion for handset and tablet applications, game controllers, motion pointer remote controls, and other consumer devices. The MPU-60X0 has an embedded 3-axis MEMS gyroscope, 3-axis MEMS accelerometer and Digital Motion Processor? (DMP) hardware accelerator engine with an auxiliary I 2 C port that interfaces to third party digital sensors, such as magnetometers. Interfacing with a 3-axis magnetometer delivers a complete 9-axis sensor fusion output to the MPU?s primary I 2 C or SPI port. (SPI is available on MPU-6000 only). This combines acceleration and rotational motion plus heading information into a single data stream for the application; GateName_1: G$1; SymbolName_1: MPU-6000; LibraryName: pixhawk2; DeviceSetName: MPU-6000; DATASHEET: http://invensense.com/mems/gyro/documents/PS-MPU-6000A-00_v1.0.pdf; LINK: http://invensense.com/mems/gyro/mpu6000.html; MFGPN: MPU-6000; PARTNO: MPU-6000
U506 = MS5611-01BA: MS5611-01BAThe MS5611-01BA is a new generation of high resolution altimeter sensors from MEAS Switzerland with SPI and I 2 C bus interface. It is optimized for altimeters and  variometers with an altitude resolution of 10 cm. The sensor module includes a high linearity pressure sensor and an ultra low power 24 bit ?? ADC with internal factory calibrated coefficients. It provides a precise digital 24 Bit pressure and temperature value and different operation modes that allow the user to optimize for conversion speed and current consumption. A high resolution temperature output allows the implementation of an altimeter/thermometer function without any additional sensor. The MS5611-01BA can be interfaced to virtually any microcontroller. The communication protocol is simple, without the need of programming internal registers in the device. Small dimensions of only 5.0 mm x 3.0 mm and a height of 1.7 mm allow for integration in mobile devices. This new sensor module generation is based on leading MEMS technology and latest benefits from  MEAS Switzerland proven experience and know-how in high volume manufacturing of altimeter modules, which have been widely used for over a decade. The sensing principle employed leads to very low hysteresis and high stability of both pressure and temperature signal.; GateName_1: G$1; SymbolName_1: MS5611-01BA; LibraryName: pixhawk2; DeviceSetName: MS5611-01BA; DATASHEET: http://www.meas-spec.com/downloads/MS5611-01BA01.pdf; LINK: http://www.meas-spec.com/product/t_product.aspx?id=8503#; MFGPN: MS5611-01BA; PARTNO: MS5611-01BA
X503 = CONN_FPC_10RA: 10-pin FPC connector for PX4 sensor board; PARTNO: 0781191109; GateName_1: G$1; SymbolName_1: KV; GateName_2: G$2; SymbolName_2: K; GateName_3: G$3; GateName_4: G$4; GateName_5: G$5; GateName_6: G$6; GateName_7: G$7; GateName_8: G$8; GateName_9: G$9; GateName_10: G$10; DeviceName: RA; BOM: EXCLUDE; SymbolName_3: K; SymbolName_4: K; SymbolName_5: K; SymbolName_6: K; SymbolName_7: K; SymbolName_8: K; SymbolName_9: K; SymbolName_10: K; LibraryName: pixhawk2; DeviceSetName: CONN_FPC_10

## Sheet PX4FMUv2.4.6_5.SchDoc: PX4FMUv2.4.6
size 282 x 200 mm; Date: 2020/2/15 15:44:29; SheetNumber: 6; GateName_1: G$1; SymbolName_1: A4L-LOC; LibraryName: pixhawk2; DeviceSetName: A4L-LOC; Value: Power and Reset
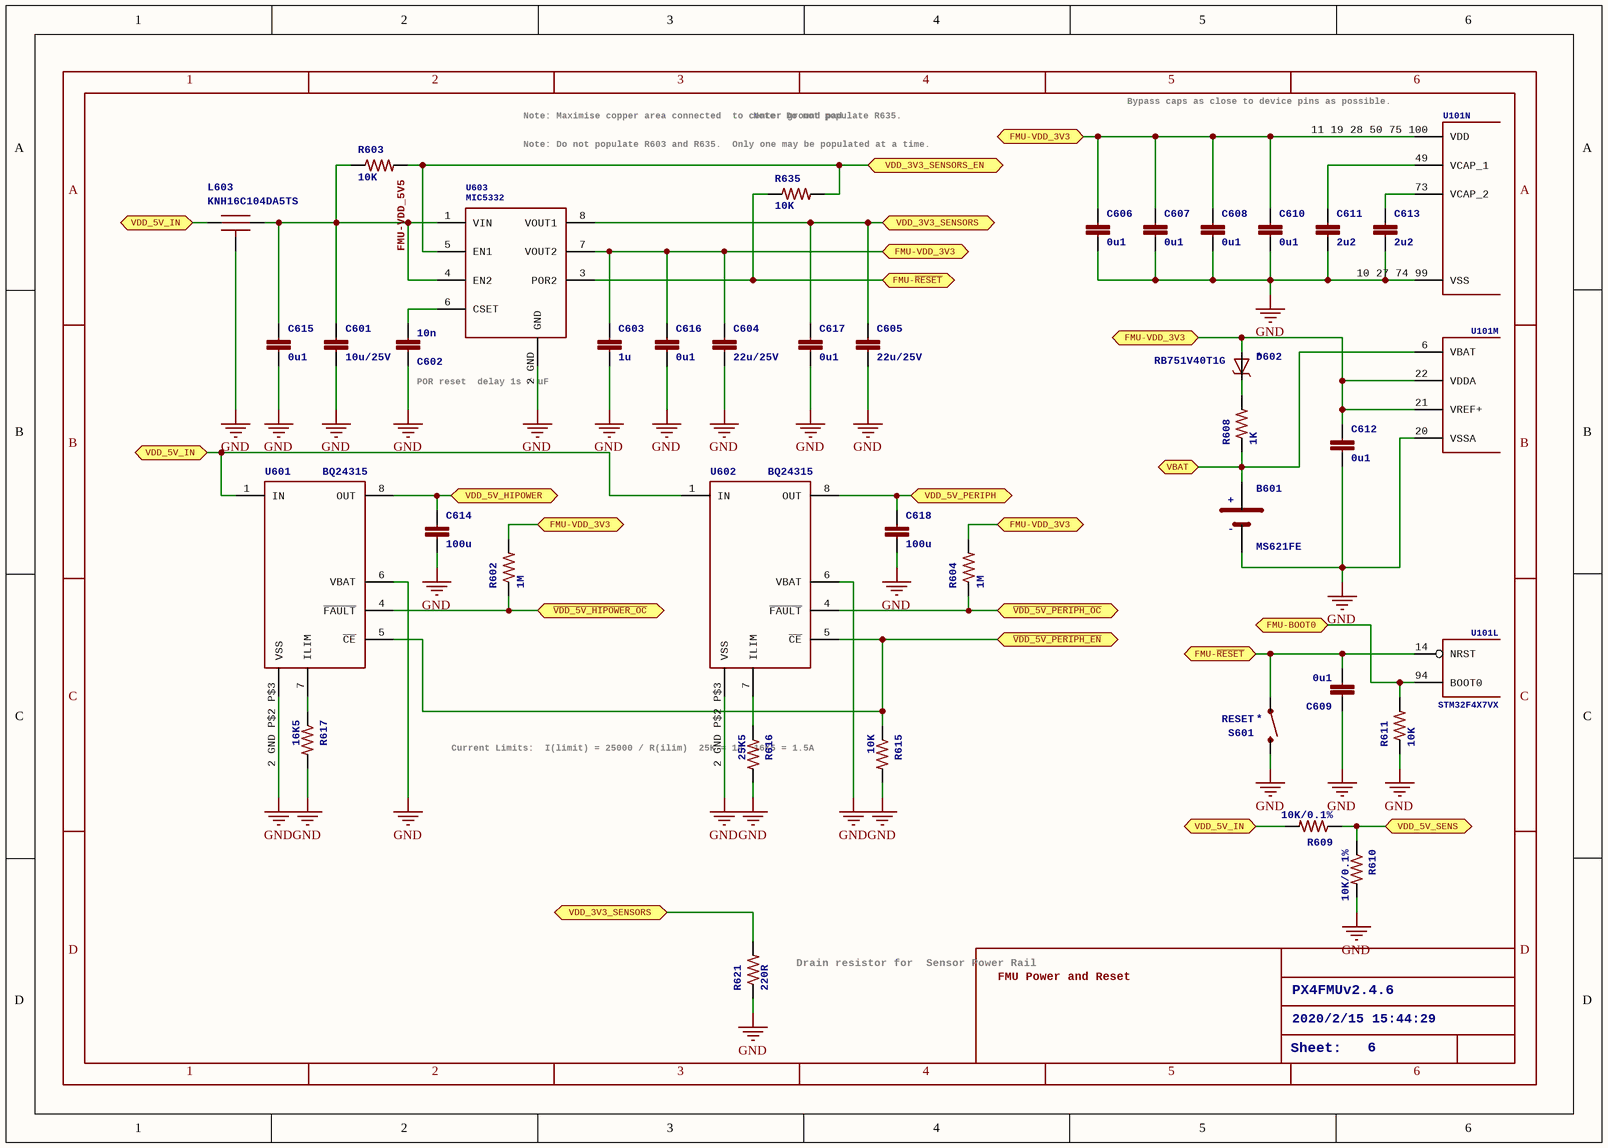
[diagram p5: PX4FMUv2.4.6_5.SchDoc]

### Parts
B601  MS621FE  [MS621FE]
C601  10u/25V  [0805-CAP]
C602  10n  [0402-CAP]
C603  1u  [0603-CAP]
C604  22u/25V  [0805-CAP]
C605  22u/25V  [0805-CAP]
C606  0u1  [0402-CAP]
C607  0u1  [0402-CAP]
C608  0u1  [0402-CAP]
C609  0u1  [0402-CAP]
C610  0u1  [0402-CAP]
C611  2u2  [0603-CAP]
C612  0u1  [0402-CAP]
C613  2u2  [0603-CAP]
C614  100u  [1206-CAP]
C615  0u1  [0402-CAP]
C616  0u1  [0402-CAP]
C617  0u1  [0402-CAP]
C618  100u  [1206-CAP]
D602  RB751V40T1G  [SOD323]
L603  KNH16C104DA5TS  [KYOCERA-KNH16-DA]
R602  1M  [0402-RES]
R603  10K  [0402-RES]
R604  1M  [0402-RES]
R608  1K  [0402-RES]
R609  10K/0.1%  [0402-RES]
R610  10K/0.1%  [0402-RES]
R611  10K  [0402-RES]
R615  10K  [0402-RES]
R616  25K5  [0402-RES]
R617  16K5  [0402-RES]
R621  220R  [0603-RES]
R635  10K  [0402-RES]
S601  RESET  [EVQP7J01K]
U101  STM32F4X7VX  [TQFP100]  (parts L,M,N of 14)
U601  BQ24315  [QFN8-DSG]
U602  BQ24315  [QFN8-DSG]
U603  MIC5332  [MLF-8-EPAD]

### Ports
FMU-BOOT0, FMU-VDD_3V3, FMU-~{RESET}, VBAT, VDD_3V3_SENSORS, VDD_3V3_SENSORS_EN, VDD_5V_HIPOWER, VDD_5V_IN, VDD_5V_PERIPH, VDD_5V_SENS, ~{VDD_5V_HIPOWER_OC}, ~{VDD_5V_PERIPH_EN}, ~{VDD_5V_PERIPH_OC}

### Nets
GND: B601.2(NEG) C601.P$2 C602.P$1 C603.P$2 C604.P$2 C605.P$2 C606.P$2 C607.P$2 C608.P$2 C609.P$1 C610.P$2 C611.P$2 C612.P$2 C613.P$2 C614.P$2 C615.P$2 C616.P$2 C617.P$2 C618.P$2 L603.P$3_P$4_P$5(P$3) R610.P$2 R611.P$1 R615.P$2 R616.P$2 R617.P$2 R621.1 S601.B3 U101.10_27_74_99(VSS) U101.20(VSSA) U601.2_GND_P$2_P$3(VSS) U601.6(VBAT) U602.2_GND_P$2_P$3(VSS) U602.6(VBAT) U603.2_GND(GND)
FMU-VDD_5V5: C601.P$1 C615.P$1 L603.P$2 R603.P$1 U603.1(VIN) U603.4(EN2)
NetB601_1: B601.1(POS) R608.P$1 U101.6(VBAT) ; port VBAT
NetC101_P$1: C603.P$1 C604.P$1 C606.P$1 C607.P$1 C608.P$1 C610.P$1 C612.P$1 C616.P$1 D602.A R602.P$2 R604.P$2 U101.11_19_28_50_75_100(VDD) U101.21(VREF+) U101.22(VDDA) U603.7(VOUT2) ; port FMU-VDD_3V3
NetC501_P$1: C605.P$1 C617.P$1 R621.2 U603.8(VOUT1) ; port VDD_3V3_SENSORS
NetC602_P$2: C602.P$2 U603.6(CSET)
NetC609_P$2: C609.P$2 R635.P$1 S601.A1 U101.14(NRST) U603.3(POR2) ; port FMU-~{RESET}
NetC611_P$1: C611.P$1 U101.49(VCAP_1)
NetC613_P$1: C613.P$1 U101.73(VCAP_2)
NetC614_P$1: C614.P$1 U601.8(OUT) ; port VDD_5V_HIPOWER
NetC618_P$1: C618.P$1 U602.8(OUT) ; port VDD_5V_PERIPH
NetC702_P$1: L603.P$1 R609.P$2 U601.1(IN) U602.1(IN) ; port VDD_5V_IN
NetD602_C: D602.C R608.P$2
NetFMU-BOOT1101_P$1: R611.P$2 U101.94(BOOT0) ; port FMU-BOOT0
NetR602_P$1: R602.P$1 U601.4(~{FAULT}) ; port ~{VDD_5V_HIPOWER_OC}
NetR603_P$2: R603.P$2 R635.P$2 U603.5(EN1) ; port VDD_3V3_SENSORS_EN
NetR604_P$1: R604.P$1 U602.4(~{FAULT}) ; port ~{VDD_5V_PERIPH_OC}
NetR609_P$1: R609.P$1 R610.P$1 ; port VDD_5V_SENS
NetR615_P$1: R615.P$1 U601.5(~{CE}) U602.5(~{CE}) ; port ~{VDD_5V_PERIPH_EN}
NetR616_P$1: R616.P$1 U602.7(ILIM)
NetR617_P$1: R617.P$1 U601.7(ILIM)

### Notes on the sheet
- Note: Maximise copper area connected
  to center ground pad.
- (near R635) Note: Do not populate R603 and R635.
  Only one may be populated at a time.
- Note: Do not populate R635.
- Bypass caps as close to device pins as possible.
- POR reset
  delay 1s / uF
- (near R616) Current Limits:
  I(limit) = 25000 / R(ilim)
  25K = 1A, 16K5 = 1.5A
- (near R621) Drain resistor for
  Sensor Power Rail
- FMU Power and Reset
- PX4FMUv2.4.6
- 2020/2/15 15:44:29
- Sheet:
- 6
- 1
- 2
- 3
- 4
- 5
- A
- B
- C
- D

### Library data of the parts
B601 = MS621FE: SEIKO 6.8mm Rechargeable 3V lithium batteryIf discontinued or not available, similar devices are available from Panasonic and Sanyo, usually direct replacements.; PARTNO: MS621FE-FL11E; GateName_1: G$1; SymbolName_1: BATTERY; LibraryName: pixhawk2; DeviceSetName: MS621FE; DATASHEET: http://speed.sii.co.jp/data/file_PRODUCT_MASTER_50112_TITLE_IMAGESP.pdf; LINK: http://search.digikey.com/us/en/products/MS621FE-FL11E/728-1057-ND/1889208; MFGPN: MS621FE; +: +; -: -
C601 = CAP0805: CapacitorStandard 0603 ceramic capacitor, and 0.1" leaded capacitor.; PARTNO: CL21A106KAYNNNE; GateName_1: G$1; SymbolName_1: CAP; DeviceName: 0805; LibraryName: pixhawk2; DeviceSetName: CAP
C602 = CAP0402: as C504 on sheet PX4FMUv2.4.6_4; LibraryName: pixhawk2; DeviceSetName: CAP
C603 = CAP0603: CapacitorStandard 0603 ceramic capacitor, and 0.1" leaded capacitor.; PARTNO: CC0603ZRY5V7BB105; GateName_1: G$1; SymbolName_1: CAP; DeviceName: 0603; LibraryName: pixhawk2; DeviceSetName: CAP
C604 C605 = CAP0805: CapacitorStandard 0603 ceramic capacitor, and 0.1" leaded capacitor.; PARTNO: CL21A226MAQNNNE; GateName_1: G$1; SymbolName_1: CAP; DeviceName: 0805; LibraryName: pixhawk2; DeviceSetName: CAP
C606-C610 C612 C615-C617 = CAP0402: as C101 on sheet PX4FMUv2.4.6_0; LibraryName: pixhawk2; DeviceSetName: CAP
C611 C613 = CAP0603: as C512 on sheet PX4FMUv2.4.6_4; LibraryName: pixhawk2; DeviceSetName: CAP
C614 C618 = CAP1206: CapacitorStandard 0603 ceramic capacitor, and 0.1" leaded capacitor.; PARTNO: C3216X5R1A107M160AC; GateName_1: G$1; SymbolName_1: CAP; DeviceName: 1206; LibraryName: pixhawk2; DeviceSetName: CAP
D602 = DIODE-SCHOTTKY_SOD323: Schottky barrier diode in DO214AC, e.g. Fairchild SS14.; GateName_1: G$1; SymbolName_1: DIODE-SCHOTTKY; DeviceName: _SOD323; LibraryName: pixhawk2; DeviceSetName: DIODE-SCHOTTKY; NAME: *; PARTNO: RB751V40T1G
L603 = KNH16C104DA5TS: as L201 on sheet PX4FMUv2.4.6_1; LibraryName: pixhawk2; DeviceSetName: KNH16C104DA5TS; PARTNO: KNH16C104DA5TS
R602 R604 = RESISTOR0402-RES: ResistorBasic schematic elements and footprints for 0603, 1206, and PTH 1/10th watt (small) resistors.; PARTNO: RC0402FR-071ML; GateName_1: G$1; SymbolName_1: RESISTOR; DeviceName: 0402-RES; LibraryName: pixhawk2; DeviceSetName: RESISTOR
R603 R611 R615 = RESISTOR0402-RES: as R102 on sheet PX4FMUv2.4.6_0; SymbolName_1: RESISTOR; DeviceName: 0402-RES; LibraryName: pixhawk2; DeviceSetName: RESISTOR
  R603: BOM: *
R608 = RESISTOR0402-RES: ResistorBasic schematic elements and footprints for 0603, 1206, and PTH 1/10th watt (small) resistors.; PARTNO: RC0402FR-071KL; GateName_1: G$1; SymbolName_1: RESISTOR; DeviceName: 0402-RES; LibraryName: pixhawk2; DeviceSetName: RESISTOR
R609 R610 = RESISTOR0402-RES: as R403 on sheet PX4FMUv2.4.6_3; SymbolName_1: RESISTOR; DeviceName: 0402-RES; LibraryName: pixhawk2; DeviceSetName: RESISTOR
R616 = RESISTOR0402-RES: ResistorBasic schematic elements and footprints for 0603, 1206, and PTH 1/10th watt (small) resistors.; PARTNO: RMCF0402FT25K5; GateName_1: G$1; SymbolName_1: RESISTOR; DeviceName: 0402-RES; LibraryName: pixhawk2; DeviceSetName: RESISTOR
R617 = RESISTOR0402-RES: ResistorBasic schematic elements and footprints for 0603, 1206, and PTH 1/10th watt (small) resistors.; PARTNO: RMCF0402FT16K5; GateName_1: G$1; SymbolName_1: RESISTOR; DeviceName: 0402-RES; LibraryName: pixhawk2; DeviceSetName: RESISTOR
R621 = RESISTOR0603-RES: ResistorBasic schematic elements and footprints for 0603, 1206, and PTH 1/10th watt (small) resistors.; PARTNO: RC1608J100CS; GateName_1: G$1; SymbolName_1: RESISTOR; DeviceName: 0603-RES; LibraryName: pixhawk2; DeviceSetName: RESISTOR
R635 = RESISTOR0402-RES: ResistorBasic schematic elements and footprints for 0603, 1206, and PTH 1/10th watt (small) resistors.; PARTNO: RC0402FR-0710KL; GateName_1: G$1; BOM: EXCLUDE; SymbolName_1: RESISTOR; DeviceName: 0402-RES; LibraryName: pixhawk2; DeviceSetName: RESISTOR
S601 = SWITCH-MOMENTARY-2: PARTNO: EVQ-P7J01P; GateName_1: G$1; SymbolName_1: SWITCH-MOMENTARY-2; LibraryName: pixhawk2; DeviceSetName: SWITCH-MOMENTARY-2; NAME: *
U101 = STM32F4X7VX: as U101 on sheet PX4FMUv2.4.6_0; SymbolName_11: OSC; LibraryName: pixhawk2; DeviceSetName: STM32F4X7VX
U601 U602 = BQ24315: PARTNO: BQ24315DSGR; GateName_1: G$1; SymbolName_1: BQ24313; LibraryName: pixhawk2; DeviceSetName: BQ24315
U603 = MIC5332: PARTNO: MIC5332-SSYMT; GateName_1: G$1; SymbolName_1: MIC5332; LibraryName: pixhawk2; DeviceSetName: MIC5332

## Sheet PX4FMUv2.4.6_6.SchDoc: PX4FMUv2.4.6
size 282 x 200 mm; Date: 2020/2/15 15:44:30; SheetNumber: 7; GateName_1: G$1; SymbolName_1: A4L-LOC; LibraryName: pixhawk2; DeviceSetName: A4L-LOC
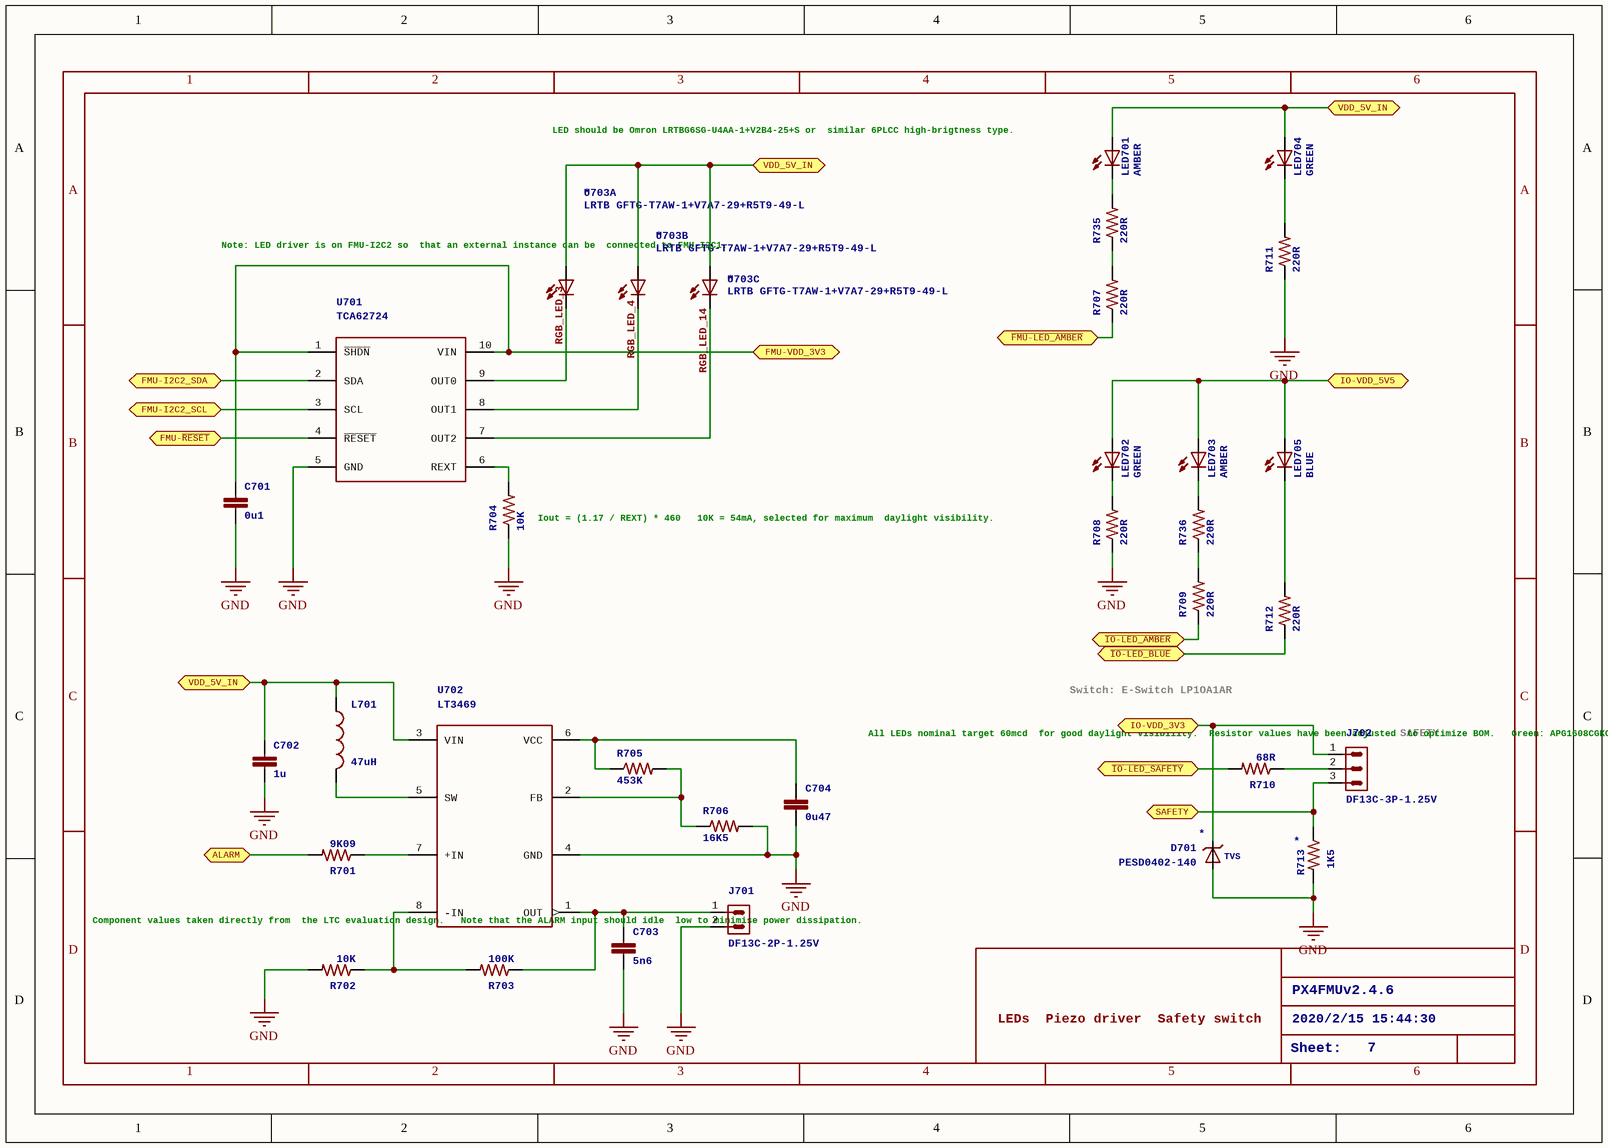
[diagram p6: PX4FMUv2.4.6_6.SchDoc]

### Parts
C701  0u1  [0402-CAP]
C702  1u  [0603-CAP]
C703  5n6  [0402-CAP]
C704  0u47  [0402-CAP]
D701  PESD0402-140  [0402-TVS]
J701  DF13C-2P-1.25V  [DF13C-2P-1.25V]
J702  DF13C-3P-1.25V  [DF13C-3P-1.25V]
L701  47uH  [0805-IND]
LED701  AMBER  [0603-LED]
LED702  GREEN  [0603-LED]
LED703  AMBER  [0603-LED]
LED704  GREEN  [0603-LED]
LED705  BLUE  [0603-LED]
R701  9K09  [0402-RES]
R702  10K  [0402-RES]
R703  100K  [0402-RES]
R704  10K  [0402-RES]
R705  453K  [0402-RES]
R706  16K5  [0402-RES]
R707  220R  [0402-RES]
R708  220R  [0402-RES]
R709  220R  [0402-RES]
R710  68R  [0402-RES]
R711  220R  [0402-RES]
R712  220R  [0402-RES]
R713  1K5  [0402-RES]
R735  220R  [0402-RES]
R736  220R  [0402-RES]
U701  TCA62724FMG  [SON10]  (value not drawn)
U702  LT3469  [SOT23-8]
U703  LRTB GFTG-T7AW-1+V7A7-29+R5T9-49-L  [6-PLCC]  (parts A,B,C of 3)

### Ports
ALARM, FMU-I2C2_SCL, FMU-I2C2_SDA, FMU-VDD_3V3, FMU-~{RESET}, IO-VDD_3V3, IO-VDD_5V5, SAFETY, VDD_5V_IN, ~{FMU-LED_AMBER}, ~{IO-LED_AMBER}, ~{IO-LED_BLUE}, ~{IO-LED_SAFETY}

### Nets
GND: C701.P$2 C702.P$2 C703.P$2 C704.P$2 D701.A J701.2 R702.P$2 R704.P$1 R706.P$2 R708.P$1 R711.P$1 R713.P$2 U701.5(GND) U702.4(GND)
RGB_LED_3: U701.9(OUT0) U703.C1(C)
RGB_LED_4: U701.8(OUT1) U703.C2(C)
RGB_LED_14: U701.7(OUT2) U703.C3(C)
NetC101_P$1: C701.P$1 U701.1(~{SHDN}) U701.10(VIN) ; port FMU-VDD_3V3
NetC609_P$2: U701.4(~{RESET}) ; port FMU-~{RESET}
NetC702_P$1: C702.P$1 L701.P$1 LED701.A LED704.A U702.3(VIN) U703.A1(A) U703.A2(A) U703.A3(A) ; port VDD_5V_IN
NetC703_P$1: C703.P$1 J701.1 R703.P$1 U702.1(OUT)
NetC704_P$1: C704.P$1 R705.P$1 U702.6(VCC)
NetC802_P$1: D701.C J702.1 ; port IO-VDD_3V3
NetC1001_P$1: LED702.A LED703.A LED705.A ; port IO-VDD_5V5
NetJ702_2: J702.2 R710.P$1
NetJ702_3: J702.3 R713.P$1 ; port SAFETY
NetL701_P$2: L701.P$2 U702.5(SW)
NetLED701_C: LED701.C R735.P$2
NetLED702_C: LED702.C R708.P$2
NetLED703_C: LED703.C R736.P$2
NetLED704_C: LED704.C R711.P$2
NetLED705_C: LED705.C R712.P$2
NetR306_P$1: U701.3(SCL) ; port FMU-I2C2_SCL
NetR307_P$1: U701.2(SDA) ; port FMU-I2C2_SDA
NetR701_P$1: R701.P$1 U702.7(+IN)
NetR701_P$2: R701.P$2 ; port ALARM
NetR702_P$1: R702.P$1 R703.P$2 U702.8(-IN)
NetR704_P$2: R704.P$2 U701.6(REXT)
NetR705_P$2: R705.P$2 R706.P$1 U702.2(FB)
NetR707_P$1: R707.P$1 ; port ~{FMU-LED_AMBER}
NetR707_P$2: R707.P$2 R735.P$1
NetR709_P$1: R709.P$1 ; port ~{IO-LED_AMBER}
NetR709_P$2: R709.P$2 R736.P$1
NetR710_P$2: R710.P$2 ; port ~{IO-LED_SAFETY}
NetR712_P$1: R712.P$1 ; port ~{IO-LED_BLUE}

### Notes on the sheet
- LED should be Omron LRTBG6SG-U4AA-1+V2B4-25+S or
  similar 6PLCC high-brigtness type.
- (near U703) Note: LED driver is on FMU-I2C2 so
  that an external instance can be
  connected to FMU-I2C1.
- (near R704) Iout = (1.17 / REXT) * 460
  10K = 54mA, selected for maximum
  daylight visibility.
- (near J702) All LEDs nominal target 60mcd
  for good daylight visibility.
  Resistor values have been adjusted
  to optimize BOM.
  Green: APG1608CGKC/T
  Vf(typ): 2.1V
  Target If: 20mA
  Selected R: 220
  Cacluated If @ 5.5V: 15mA
  Amber: APT1608SECK
  Vf(typ): 2.1V
  Target If: 5mA
  Selected R: 440
  Cacluated If @ 5.5V: 8mA
  Blue: APT1608QBC/G
  Vf(typ): 3.3V
  Target If: 6.6mA
  Selected R: 220
  Cacluated If @ 5.5V: 10mA
- Switch: E-Switch LP1OA1AR
- SAFETY
- Component values taken directly from
  the LTC evaluation design.
  Note that the ALARM input should idle
  low to minimise power dissipation.
- LEDs
  Piezo driver
  Safety switch
- PX4FMUv2.4.6
- 2020/2/15 15:44:30
- Sheet:
- 7
- 1
- 2
- 3
- 4
- 5
- 6
- A
- B
- C
- D

### Library data of the parts
C701 = CAP0402: as C101 on sheet PX4FMUv2.4.6_0; LibraryName: pixhawk2; DeviceSetName: CAP
C702 = CAP0603: as C603 on sheet PX4FMUv2.4.6_5; LibraryName: pixhawk2; DeviceSetName: CAP
C703 = CAP0402: CapacitorStandard 0603 ceramic capacitor, and 0.1" leaded capacitor.; PARTNO: C0402C562K5RACTU; GateName_1: G$1; SymbolName_1: CAP; DeviceName: 0402; LibraryName: pixhawk2; DeviceSetName: CAP
C704 = CAP0402: as C510 on sheet PX4FMUv2.4.6_4; LibraryName: pixhawk2; DeviceSetName: CAP
D701 = DIODE-TVS: GateName_1: G$1; SymbolName_1: DIODE-TVS; LibraryName: pixhawk2; DeviceSetName: DIODE-TVS; NAME: *; PARTNO: PESD0402-140; TVS: TVS
J701 = DF13-2P-1.25V: DF13-2P 1.25mm Pitch Miniature Crimping Connector.; PARTNO: DF13C-2P-1.25V(20); GateName_1: G$1; SymbolName_1: CON-1X2P; DeviceName: V; LibraryName: con-hirose-df13; DeviceSetName: DF13-2P-1.25
J702 = DF13-3P-1.25V: as J402 on sheet PX4FMUv2.4.6_3; LibraryName: con-hirose-df13; DeviceSetName: DF13-3P-1.25
L701 = INDUCTOR0805: InductorsBasic Inductor/Choke - 0603 and 1210. Footprints are not proven and vary greatly between part numbers. SRR1210: Bourns SRR1210 parts, e.g. SRR1210-100M; PARTNO: MLZ2012M470W; GateName_1: G$1; DeviceName: 0805; SymbolName_1: INDUCTOR; LibraryName: pixhawk2; DeviceSetName: INDUCTOR
LED701 LED703 = LED0603: LEDsStandard schematic elements and footprints for 5mm, 3mm, 1206, and 0603 sized LEDs. 5mm - Spark Fun Electronics SKU : COM-00529 (and others); PARTNO: APTD1608SECK; GateName_1: G$1; SymbolName_1: LED; DeviceName: 0603; LibraryName: pixhawk2; DeviceSetName: LED
LED702 LED704 = LED0603: LEDsStandard schematic elements and footprints for 5mm, 3mm, 1206, and 0603 sized LEDs. 5mm - Spark Fun Electronics SKU : COM-00529 (and others); PARTNO: APTD1608CGCK; GateName_1: G$1; SymbolName_1: LED; DeviceName: 0603; LibraryName: pixhawk2; DeviceSetName: LED
LED705 = LED0603: LEDsStandard schematic elements and footprints for 5mm, 3mm, 1206, and 0603 sized LEDs. 5mm - Spark Fun Electronics SKU : COM-00529 (and others); PARTNO: APTD1608QBC/D; GateName_1: G$1; SymbolName_1: LED; DeviceName: 0603; LibraryName: pixhawk2; DeviceSetName: LED
R701 = RESISTOR0402-RES: ResistorBasic schematic elements and footprints for 0603, 1206, and PTH 1/10th watt (small) resistors.; PARTNO: RMCF0402FT9K09; GateName_1: G$1; SymbolName_1: RESISTOR; DeviceName: 0402-RES; LibraryName: pixhawk2; DeviceSetName: RESISTOR
R702 R704 = RESISTOR0402-RES: as R102 on sheet PX4FMUv2.4.6_0; SymbolName_1: RESISTOR; DeviceName: 0402-RES; LibraryName: pixhawk2; DeviceSetName: RESISTOR
R703 = RESISTOR0402-RES: as R301 on sheet PX4FMUv2.4.6_2; SymbolName_1: RESISTOR; DeviceName: 0402-RES; LibraryName: pixhawk2; DeviceSetName: RESISTOR
R705 = RESISTOR0402-RES: ResistorBasic schematic elements and footprints for 0603, 1206, and PTH 1/10th watt (small) resistors.; PARTNO: RMCF0402FT453K; GateName_1: G$1; SymbolName_1: RESISTOR; DeviceName: 0402-RES; LibraryName: pixhawk2; DeviceSetName: RESISTOR
R706 = RESISTOR0402-RES: as R617 on sheet PX4FMUv2.4.6_5; SymbolName_1: RESISTOR; DeviceName: 0402-RES; LibraryName: pixhawk2; DeviceSetName: RESISTOR
R707-R709 R711 R712 R735 R736 = RESISTOR0402-RES: ResistorBasic schematic elements and footprints for 0603, 1206, and PTH 1/10th watt (small) resistors.; PARTNO: RC0402FR-07220RL; GateName_1: G$1; SymbolName_1: RESISTOR; DeviceName: 0402-RES; LibraryName: pixhawk2; DeviceSetName: RESISTOR
R710 = RESISTOR0402-RES: ResistorBasic schematic elements and footprints for 0603, 1206, and PTH 1/10th watt (small) resistors.; PARTNO: ERJ-2GEJ680X; GateName_1: G$1; SymbolName_1: RESISTOR; DeviceName: 0402-RES; LibraryName: pixhawk2; DeviceSetName: RESISTOR
R713 = RESISTOR0402-RES: as R306 on sheet PX4FMUv2.4.6_2; SymbolName_1: RESISTOR; DeviceName: 0402-RES; LibraryName: pixhawk2; DeviceSetName: RESISTOR; NAME: *
U701 = TCA62724FMG: Toshiba TCA62724FMG I2C RGB LED driver; GateName_1: G$1; SymbolName_1: TCA62724; LibraryName: pixhawk2; DeviceSetName: TCA62724FMG; PARTNO: TCA62724FMG; TCA62724: TCA62724
U702 = LT3469: LT3469 Piezo microactuator driver with boost regulator; PARTNO: LT3469ETS8; GateName_1: G$1; SymbolName_1: LT3469; LibraryName: pixhawk2; DeviceSetName: LT3469
U703 = RGB-LED6-PLCC: RGB LED with separate anode/cathode terminals; GateName_1: BLUE; GateName_2: GREEN; GateName_3: RED; SymbolName_1: LED; SymbolName_2: LED; SymbolName_3: LED; DeviceName: 6-PLCC; LibraryName: pixhawk2; DeviceSetName: RGB-LED; NAME: *; PARTNO: LRTB GFTG-T7AW-1+V7A7-29+R5T9-49-L